# EasyEDA Pro project 智能开关_v2.eprj

# Schematic Schematic1
Create Date: 2024-02-22; Page Name: P1; Project Name: 智能开关; Schematic Name: Schematic1; Update Date: 2024-02-26; Drawed: 赛博小姬; Page Size: A4; Version: V1.0
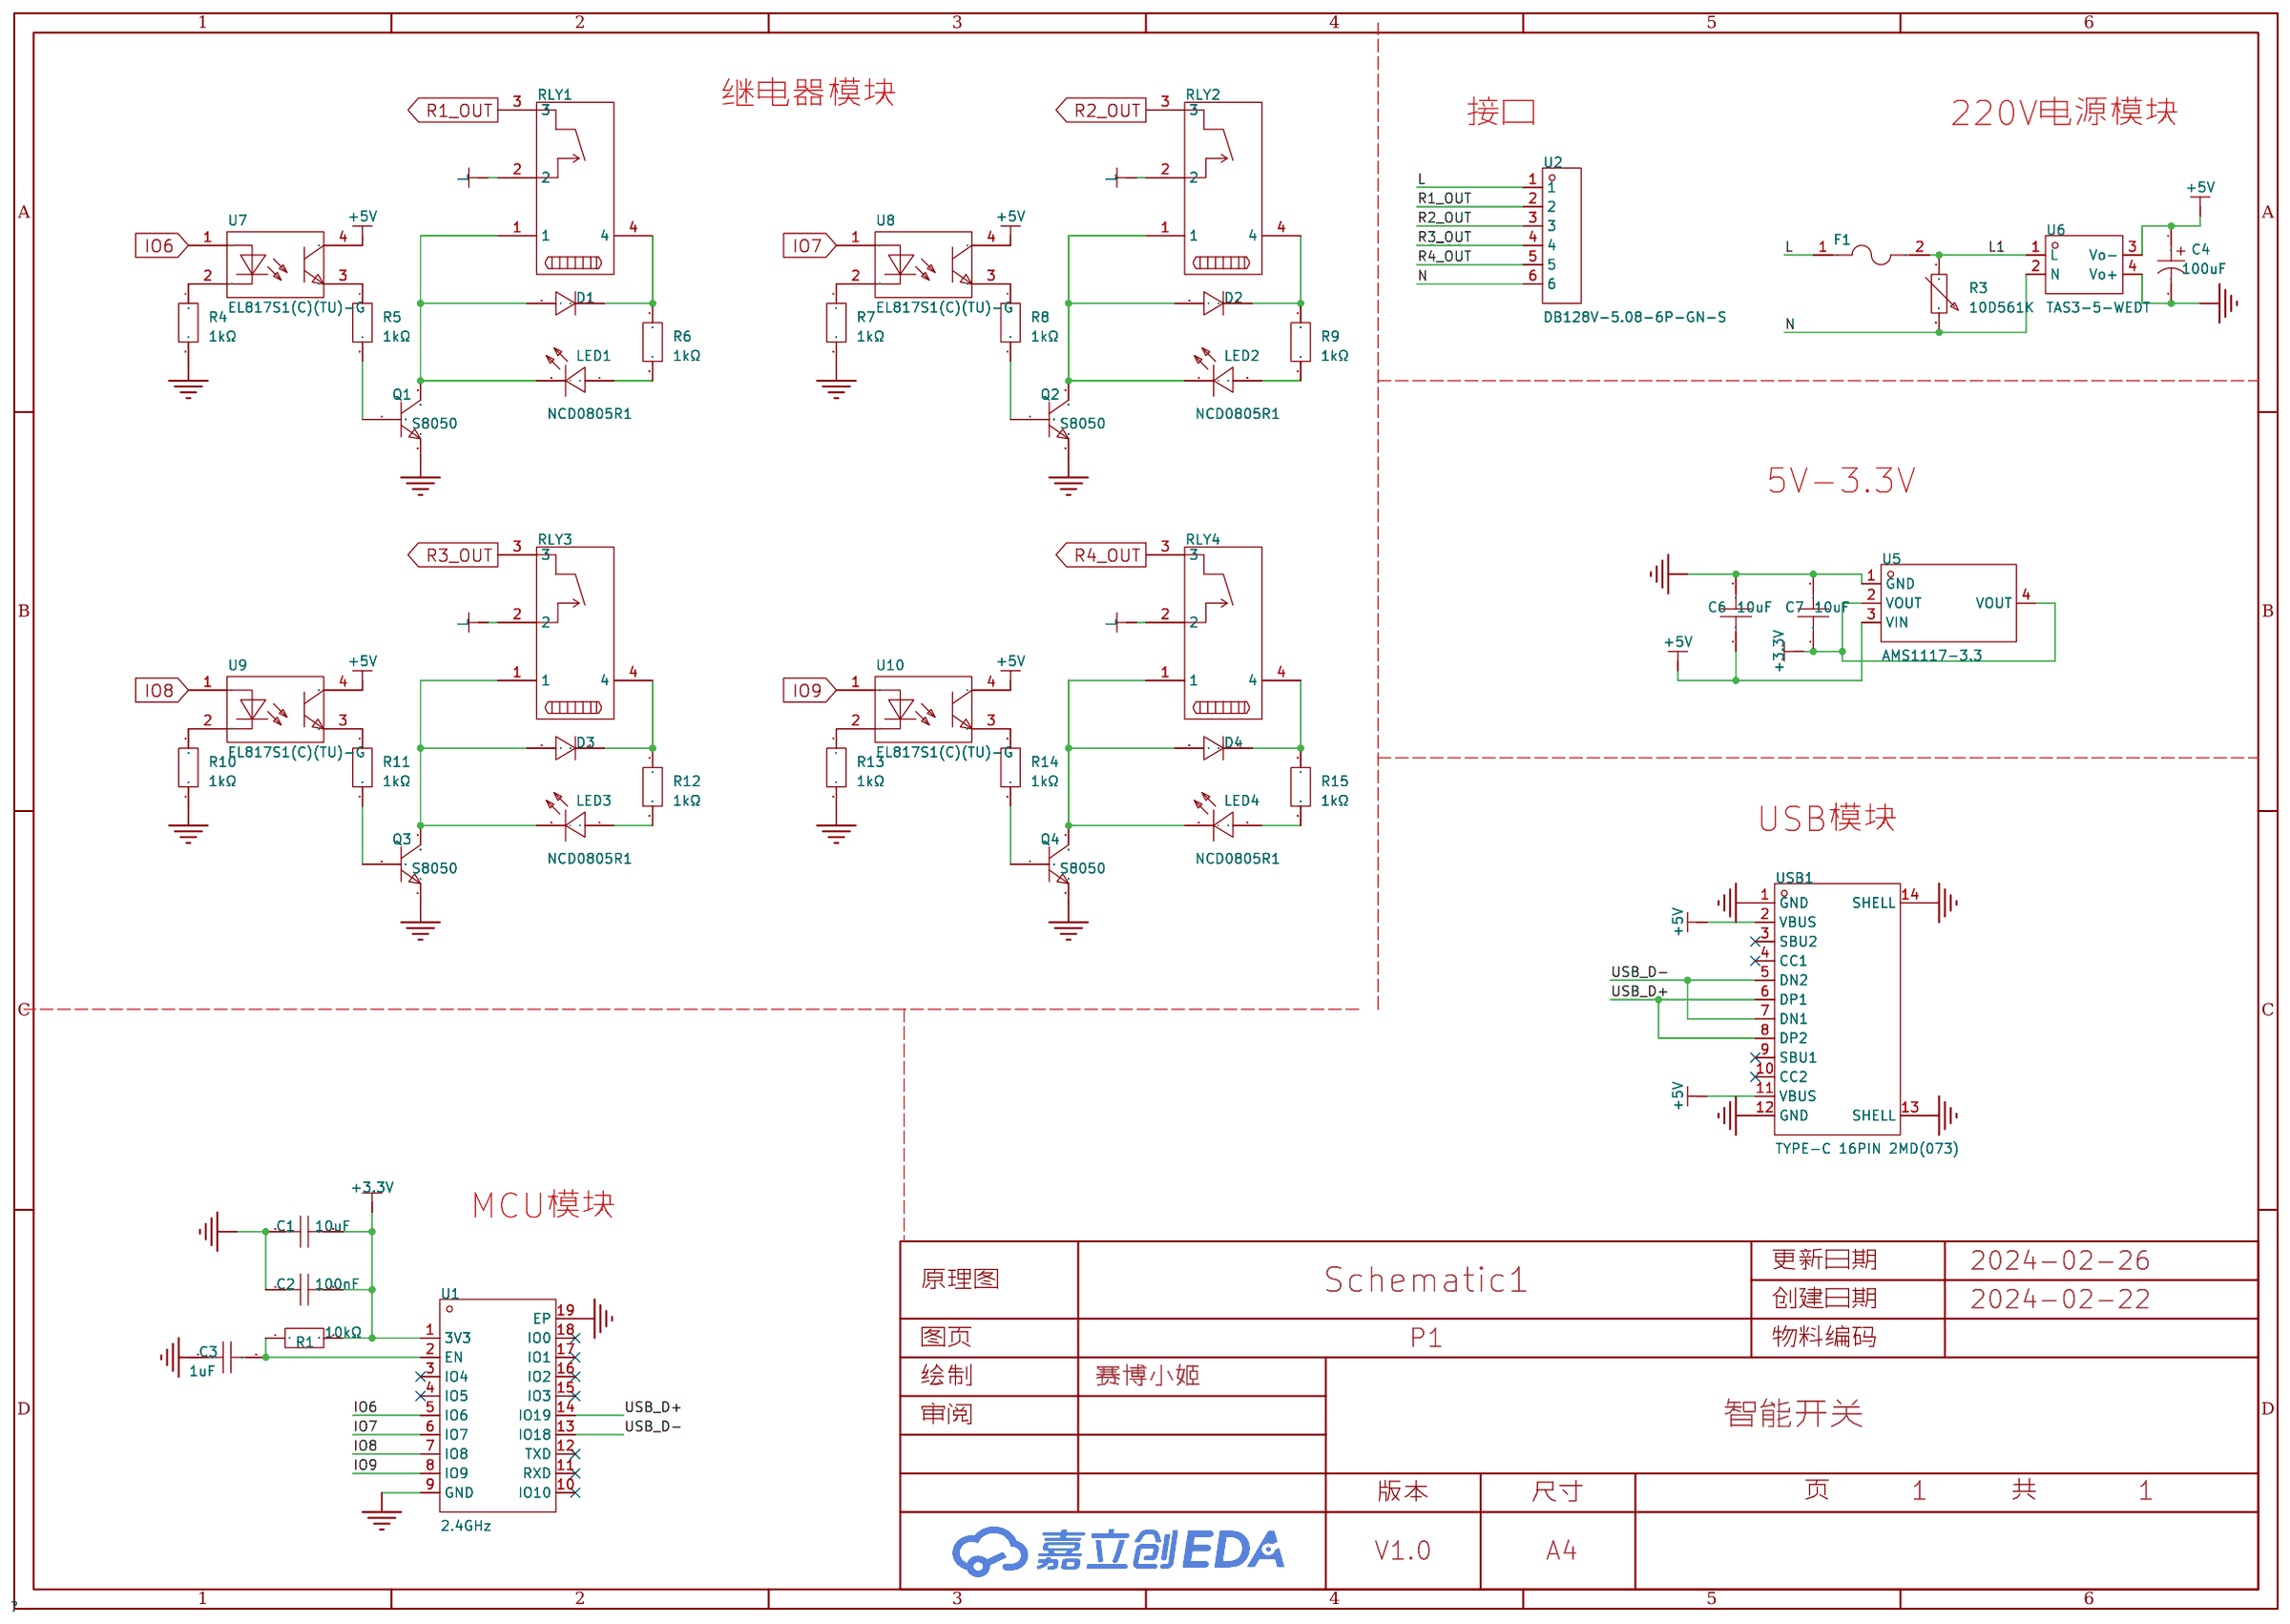
[diagram p0: schematic sheet]

## Parts
C1  10uF  [C0603]
C2  100nF  [C0603]
C3  1uF  [C0603]
C4  100uF  [CAP-SMD_BD6.3-L6.6-W6.6-LS7.3-FD]
C6  10uF  [C0603]
C7  10uF  [C0603]
D1  M4  [SMA_L4.3-W2.6-LS5.2-RD]
D2  M4  [SMA_L4.3-W2.6-LS5.2-RD]
D3  M4  [SMA_L4.3-W2.6-LS5.2-RD]
D4  M4  [SMA_L4.3-W2.6-LS5.2-RD]
F1  JFC2410-1200TS  [F2410]
LED1  NCD0805R1  [LED0805-R-RD]
LED2  NCD0805R1  [LED0805-R-RD]
LED3  NCD0805R1  [LED0805-R-RD]
LED4  NCD0805R1  [LED0805-R-RD]
Q1  S8050  [SOT-23-3_L2.9-W1.3-P1.90-LS2.4-BR]
Q2  S8050  [SOT-23-3_L2.9-W1.3-P1.90-LS2.4-BR]
Q3  S8050  [SOT-23-3_L2.9-W1.3-P1.90-LS2.4-BR]
Q4  S8050  [SOT-23-3_L2.9-W1.3-P1.90-LS2.4-BR]
R1  10kΩ  [R0603]
R3  10D561K  [RES-TH_L13.0-W6.0-P7.50-D0.9-S6.00]
R4  1kΩ  [R0603]
R5  1kΩ  [R0603]
R6  1kΩ  [R0402]
R7  1kΩ  [R0603]
R8  1kΩ  [R0603]
R9  1kΩ  [R0402]
R10  1kΩ  [R0603]
R11  1kΩ  [R0603]
R12  1kΩ  [R0402]
R13  1kΩ  [R0603]
R14  1kΩ  [R0603]
R15  1kΩ  [R0402]
RLY1  G5NB-1A-E-DC5V  [RELAY-TH_G5NB-1A-E-DCXX]
RLY2  G5NB-1A-E-DC5V  [RELAY-TH_G5NB-1A-E-DCXX]
RLY3  G5NB-1A-E-DC5V  [RELAY-TH_G5NB-1A-E-DCXX]
RLY4  G5NB-1A-E-DC5V  [RELAY-TH_G5NB-1A-E-DCXX]
U1  2.4GHz  [BULETM-SMD_ESPRESSIF_ESP32-C3-WROOM-02-N4-4MB]
U2  DB128V-5.08-6P-GN-S  [CONN-TH_6P-P5.08_DIBO_DB128V-5.08]
U5  AMS1117-3.3  [SOT-223-3_L6.5-W3.4-P2.30-LS7.0-BR]
U6  TAS3-5-WEDT  [PWRM-TH_TAS3-XX-WEDT]
U7  EL817S1(C)(TU)-G  [OPTO-SMD-4_L4.6-W6.5-P2.54-LS10.3-TL]
U8  EL817S1(C)(TU)-G  [OPTO-SMD-4_L4.6-W6.5-P2.54-LS10.3-TL]
U9  EL817S1(C)(TU)-G  [OPTO-SMD-4_L4.6-W6.5-P2.54-LS10.3-TL]
U10  EL817S1(C)(TU)-G  [OPTO-SMD-4_L4.6-W6.5-P2.54-LS10.3-TL]
USB1  TYPE-C 16PIN 2MD(073)  [USB-C-SMD_TYPE-C-6PIN-2MD-073]

## Library data of the parts
C1 = CL10A106KP8NNNC: 容值:10uF;精度:±10%;额定电压:10V;材质(温度系数):X5R;; LCSC Part Name: 10uF ±10% 10V; Supplier Part: C19702; Manufacturer: SAMSUNG(三星); Supplier Footprint: 0603; JLCPCB Part Class: Basic Part; Datasheet: https://atta.szlcsc.com/upload/public/pdf/source/20160218/1457707763339.pdf; Supplier: LCSC; Tolerance: ±10%; Voltage Rated: 10V; Temperature Coefficient: X5R
C2 = CC0603KRX7R9BB104: 容值:100nF;精度:±10%;额定电压:50V;材质(温度系数):X7R;; LCSC Part Name: 100nF ±10% 50V; Supplier Part: C14663; Manufacturer: YAGEO(国巨); Supplier Footprint: 0603; JLCPCB Part Class: Basic Part; Datasheet: https://atta.szlcsc.com/upload/public/pdf/source/20180910/C282072_33301C7F631E79921B82A8DAC6BCC5B3.pdf; Supplier: LCSC; Tolerance: ±10%; Voltage Rated: 50V; Temperature Coefficient: X7R
C3 = AC0603KRX7R8BB105: 容值:1uF;精度:±10%;额定电压:25V;材质(温度系数):X7R;; LCSC Part Name: 1uF ±10% 25V; Supplier Part: C726560; Manufacturer: YAGEO(国巨); Supplier Footprint: 0603; JLCPCB Part Class: 扩展库; Datasheet: https://atta.szlcsc.com/upload/public/pdf/source/20200820/C726560_B4B2560EFD85E96D92AFCD5D296BB6F1.pdf; Supplier: LCSC; Tolerance: ±10%; Voltage Rated: 25V; Temperature Coefficient: X7R
C4 = RST100UF25V004: 容值:100uF;精度:±20%;额定电压:25V;纹波电流:88mA@120Hz;等效串联电阻:-;; LCSC Part Name: 100uF ±20% 25V; Supplier Part: C4747964; Manufacturer: KNSCHA(科尼盛); Supplier Footprint: SMD,D6.3xL5.4mm; JLCPCB Part Class: 扩展库; Datasheet: https://atta.szlcsc.com/upload/public/pdf/source/20220722/52F6C209ACF875FF59C64C72CE2329EE.pdf; Supplier: LCSC; Tolerance: ±20%; Rated Voltage: 25V; Ripple Current: 88mA@120Hz; φD: 6.3mm; L: 5.4mm; Lifetime @ Temp: 2000hrs@105℃; Operating Temperature: -40℃~+105℃
C6 C7 = 0603X106M250NT: 容值:10uF;精度:±20%;额定电压:25V;材质(温度系数):X5R;; LCSC Part Name: 10uF ±20% 25V; Supplier Part: C479655; Manufacturer: FH(风华); Supplier Footprint: 0603; JLCPCB Part Class: 扩展库; Datasheet: https://atta.szlcsc.com/upload/public/pdf/source/20200305/C486355_26A10D38EF8C2A5C37091D0039909270.pdf; Supplier: LCSC; Tolerance: ±20%; Voltage Rated: 25V; Temperature Coefficient: X5R
D1-D4 = M4_C18207: 二极管配置:-;正向压降(Vf):1.1V@1A;直流反向耐压(Vr):400V;平均整流电流(Io):1A;; LCSC Part Name: 电压:400V 电流:1A; Supplier Part: C18207; Manufacturer: 星海; Supplier Footprint: SMA(DO-214AC); JLCPCB Part Class: 扩展库; Datasheet: https://atta.szlcsc.com/upload/public/pdf/source/20161112/1478931640032.pdf; Supplier: LCSC; Forward Voltage (Vf@If): 1.1V@1A; Reverse Voltage (Vr): 400V; Average Rectified Current (Io): 1A; Reverse Leakage Current: 5uA@400V
F1 = JFC2410-1200TS: 类型:贴片式保险丝;额定电流:2A;额定电压 (AC):250V;额定电压 (DC):250V;分断能力:50A;; LCSC Part Name: 250V贴片式保险丝; Supplier Part: C136382; Manufacturer: JDTfuse(集电通); Supplier Footprint: SMD; JLCPCB Part Class: 扩展库; Datasheet: https://atta.szlcsc.com/upload/public/pdf/source/20230515/1D43BDD82FA89335B41B370141760CD9.pdf; Supplier: LCSC; Type: 贴片式保险丝; Current Rating: 2A; Voltage Rating  (AC): 250V; Voltage Rating (DC): 250V; Operating Temperature: -55℃~+125℃; Breaking Capacity: 50A
LED1-LED4 = NCD0805R1: 灯头类型:-;发光颜色:红色;正向电压(VF):1.6V~2.6V;功率:65mW;正向电流:20mA;主波长:615nm~630nm;二极管配置:独立二极管;透镜颜色:无色透明透镜;色温:-;发光强度:67mcd~195mcd;发光角度:130°;载带方式:-;工作温度:-30℃~+85℃;; Supplier Part: C84256; Manufacturer: 国星光电; Supplier Footprint: 0805; JLCPCB Part Class: 基础库; Datasheet: https://atta.szlcsc.com/upload/public/pdf/source/20200820/C84256_F0A75A43B3EAD75808600A0514C76B99.pdf; Supplier: LCSC; Emitted Color: 红色; Forward Voltage (VF): 1.6V~2.6V; Power Dissipation: 65mW; Forward Current: 20mA; Dominant Wavelength: 615nm~630nm; Diode Configuration: 独立二极管; Lens Color: 无色透明透镜; Luminous Intensity: 67mcd~195mcd; Viewing Angle: 130°; Operating Temperature: -30℃~+85℃
Q1-Q4 = S8050_C139514: 晶体管类型:NPN;集电极电流(Ic):500mA;集射极击穿电压(Vceo):25V;功率(Pd):300mW;; LCSC Part Name: 耐压:25V 电流:500mA NPN; Supplier Part: C139514; Supplier Footprint: SOT-23; JLCPCB Part Class: 扩展库; Datasheet: https://atta.szlcsc.com/upload/public/pdf/source/20171116/C139514_15108221321741123744.pdf; Supplier: LCSC; Transistor Type: NPN; Collector Current (Ic): 500mA; Collector-Emitter Breakdown Voltage (Vceo): 25V; Power Dissipation (Pd): 300mW
R1 = SC0603F1002F2BNRH: 阻值:10kΩ;精度:±1%;功率:-;温度系数:±100ppm/℃;; LCSC Part Name: 10kΩ ±1%; Supplier Part: C3152123; Manufacturer: Sunway(信维通信); Supplier Footprint: 0603; JLCPCB Part Class: 扩展库; Datasheet: https://atta.szlcsc.com/upload/public/pdf/source/20220728/FFCE43BB6DF8FA16AEE331F0F4B289DE.pdf; Supplier: LCSC; Tolerance: ±1%; Temperature Coefficient: ±100ppm/℃
R3 = 10D561K_C113236: 压敏电压:504V~616V;钳位电压:920V;最大工作电压(DC):460V;最大工作电压(AC):350V;; LCSC Part Name: 钳位电压920V 42.3焦耳 插件压敏电阻; Supplier Part: C113236; Manufacturer: HEL(鸿志); Supplier Footprint: 插件; Datasheet: https://atta.szlcsc.com/upload/public/pdf/source/20171026/C136820_15089842275381059197.pdf; Supplier: LCSC; Varistor Voltage: 504V~616V; Clamping Voltage: 920V; Allowable Voltage (DC): 460V; Allowable Voltage (AC): 350V; Peak Current: 2.5kA; Maximum Energy: 42.3J; Typical Capatitance: 180pF@1kHz
R4 R5 R7 R8 R10 R11 R13 R14 = SCR0603F1K: 电阻类型:厚膜电阻;阻值:1kΩ;精度:±1%;功率:100mW;最大工作电压:75V;; LCSC Part Name: 厚膜电阻 1kΩ ±1% 100mW; Supplier Part: C3016283; Manufacturer: VO(翔胜); Supplier Footprint: 0603; JLCPCB Part Class: 扩展库; Datasheet: https://atta.szlcsc.com/upload/public/pdf/source/20220513/247AF9639BA21CF93567DC289CCC6A22.pdf; Supplier: LCSC; Type: 厚膜电阻; Tolerance: ±1%; Power(Watts): 100mW; Overload Voltage (Max): 75V; Operating Temperature Range: -55℃~+155℃
R6 R9 R12 R15 = RT0402FRE131KL: 电阻类型:薄膜电阻;阻值:1kΩ;精度:±1%;功率:63mW;温度系数:±50ppm/℃;; LCSC Part Name: 薄膜电阻 1kΩ ±1% 63mW; Supplier Part: C5455558; Manufacturer: YAGEO(国巨); Supplier Footprint: 0402; JLCPCB Part Class: 扩展库; Datasheet: https://atta.szlcsc.com/upload/public/pdf/source/20221229/9BDC4C850F6F9D95EFF69854CFE12DCA.pdf; Supplier: LCSC; Type: 薄膜电阻; Tolerance: ±1%; Power(Watts): 63mW; Temperature Coefficient: ±50ppm/℃; Operating Temperature Range: -55℃~+155℃
RLY1-RLY4 = G5NB-1A-E-DC5V: 线圈电压:-;触点形式:-;触点容量(电阻负载):-;最大切换电压:-;最大切换电流:-;; Supplier Part: C48746; Manufacturer: OMRON(欧姆龙); Supplier Footprint: 插件,7x20.4mm; JLCPCB Part Class: 扩展库; Supplier: LCSC
U1 = ESP32-C3-WROOM-02-N4: 核心处理器:ESP32-C3芯片;频率:2.4GHz;发射功率:20.5dBm;; Supplier Part: C2934560; Manufacturer: ESPRESSIF(乐鑫); Supplier Footprint: VFQFN-32-EP; JLCPCB Part Class: 扩展库; Datasheet: https://atta.szlcsc.com/upload/public/pdf/source/20220106/F07459EFFE1D7CBA94B4FB8A075146A6.pdf; Supplier: LCSC; Core Processor: ESP32-C3芯片; Support Interface: I2C；GPIO；SPI；JTAG；UART；USB；I2S; Output Power: 20.5dBm
U2 = DB128V-5.08-6P-GN-S: 结构:1x6P;间距:5.08mm;颜色:绿色;安装方式:直插;额定电流:20A;额定电压:300V;排数:1;线规 - AWG:12~30;线规 - 平方毫米:2.5;每排PIN数:6;工作温度范围:-40℃~+105℃;; LCSC Part Name: 5.08mm 1x6P 排数:1 每排P数:6 直插; Supplier Part: C2915642; Manufacturer: DORABO(地博电气); Supplier Footprint: 插件,P=5.08mm; JLCPCB Part Class: Extended Part; Datasheet: https://atta.szlcsc.com/upload/public/pdf/source/20230106/CC449C10514519CDCE20F1C37DBF2DAC.pdf; Supplier: LCSC; Structure: 1x6P; Pitch: 5.08mm; Color: 绿色; Mounting Style: 直插; Current Rating (Max): 20A; Voltage Rating (Max): 300V; Number of Pins: 6P; Number of Rows: 1; Wire Gauge - AWG: 12~30; Wire Gauge - mm2: 2.5; Number of PINs Per Row: 6; Operating Temperature Range: -40℃~+105℃; Contact Material: 铜合金; Contact Plating: 锡
U5 = AMS1117-3.3_C6186: 输出类型:固定;最大输入电压:-;输出电压:3.3V;最大输出电流:1A;电源纹波抑制比(PSRR):72dB@(120Hz);输出极性:正极;; LCSC Part Name: 输出3.3V 1A; Supplier Part: C6186; Manufacturer: AMS; Supplier Footprint: SOT-223-3; JLCPCB Part Class: 基础库; Datasheet: https://atta.szlcsc.com/upload/public/pdf/source/20180727/C6186_7A095716F0823C02F1997A905E26C086.pdf; Supplier: LCSC; Output Type: 固定; Output Voltage: 3.3V; MAX Output Current: 1A; Power Supply Rejection Ratio (PSRR): 72dB@(120Hz); Dropout Voltage: 1.3V@(800mA); Output Polarity: 正极; Number of Outputs: 1
U6 = TAS3-5-WEDT: 转换类型:AC-DC；AC/DC-DC;输入电压(DC):100V~370V;输出电压:5V;输出功率:3W;输入电压(AC):85VAC~265VAC;输出电流(最大值):600mA;功能类型:降压型;转换效率:75%;; Supplier Part: C570795; Manufacturer: TDPOWER(腾达电源); Supplier Footprint: 插件,19x38mm; JLCPCB Part Class: 扩展库; Datasheet: https://atta.szlcsc.com/upload/public/pdf/source/20200629/C570795_2BCE2CBAC4D476E03C2D62BDB5C231E8.pdf; Supplier: LCSC; Conversion Type: AC-DC；AC/DC-DC; Input Voltage(DC): 100V~370V; Output Voltage: 5V; Output Power: 3W; Input Voltage(AC): 85VAC~265VAC; Output Current (Max): 600mA; Function: 降压型; Isolation or not: 隔离; Output Channel: 1; Insulated Voltage: 2.5kV@AC; Conversion Efficiency: 75%; Feature: 过流保护；短路保护自恢复
U7-U10 = EL817S1(C)(TU)-G: 输入电压类型:DC;正向电压:1.2V;输出电流:50mA;隔离电压(rms):5kV;反向电压:6V;接收端电压:35V;输出通道数:1;集射极饱和电压(Vce(sat)@Ic,IF):100mV@1mA,20mA;; LCSC Part Name: DC输入 隔离电压(rms):5000V; Supplier Part: C414641; Manufacturer: EVERLIGHT(亿光); Supplier Footprint: SMD-4P; JLCPCB Part Class: 扩展库; Datasheet: https://atta.szlcsc.com/upload/public/pdf/source/20190822/C414642_3676B2E93CB19DCF416503E5753ACA8D.pdf; Supplier: LCSC; Input voltage type: DC; Output Type: 光电三极管; Forward Voltage: 1.2V; Output Current: 50mA; Isolation Voltage(rms): 5kV; Reverse Voltage: 6V; Receiving End Voltage: 35V; Number of Outputs: 1; Collector-Emitter Saturation Voltage (Vce(sat)@Ic,IF): 100mV@1mA,20mA; Rise time: 18us@2mA,100Ω; Fall time: 18us@2mA,100Ω; Operating Temperature: -55℃~+110℃
USB1 = TYPE-C 16PIN 2MD(073): 连接器类型:Type-C;标准:-;公母:母;端口数量:1;触点数量:16P;安装方式:卧贴;额定电流 - 电源:5A;工作温度范围:-25℃~+85℃;; LCSC Part Name: Type-C 母 卧贴; Supplier Part: C2765186; Manufacturer: SHOU HAN(首韩); Supplier Footprint: SMD; JLCPCB Part Class: 扩展库; Datasheet: https://atta.szlcsc.com/upload/public/pdf/source/20211123/39B17C16241EAC15C5E277BDA434118E.pdf; Supplier: LCSC; Connector Type: Type-C; Gender: 母; Number of Ports: 1; Number of Contacts: 16P; Mounting Style: 卧贴; Current Rating - Power (Max): 5A; Operating Temperature Range: -25℃~+85℃

## Nets
+3.3V: C1.2 C2.2 C7.1 R1.2 U1.1(3V3) U5.2(VOUT) U5.4(VOUT)
+5V: C4.1 C6.1 U5.3(VIN) U6.3(Vo-) U7.4 U8.4 U9.4 U10.4 USB1.2(VBUS) USB1.11(VBUS)
GND: C1.1 C2.1 C3.1 C4.2 C6.2 C7.2 Q1.2(E) Q2.2(E) Q3.2(E) Q4.2(E) R4.2 R7.2 R10.2 R13.2 U1.9(GND) U1.19(EP) U5.1(GND) U6.4(Vo+) USB1.1(GND) USB1.12(GND) USB1.13(SHELL) USB1.14(SHELL)
IO6: U1.5(IO6) U7.1
IO7: U1.6(IO7) U8.1
IO8: U1.7(IO8) U9.1
IO9: U1.8(IO9) U10.1
L: F1.1 RLY1.2 RLY2.2 RLY3.2 RLY4.2 U2.1
L1: F1.2 R3.1 U6.1(L)
N: R3.2 U2.6 U6.2(N)
R1_OUT: RLY1.3 U2.2
R2_OUT: RLY2.3 U2.3
R3_OUT: RLY3.3 U2.4
R4_OUT: RLY4.3 U2.5
USB_D+: U1.14(IO19) USB1.6(DP1) USB1.8(DP2)
USB_D-: U1.13(IO18) USB1.5(DN2) USB1.7(DN1)
$1N798: C3.2 R1.1 U1.2(EN)
$1N5128: R4.1 U7.2
$1N5169: R5.1 U7.3
$1N5245: Q1.1(B) R5.2
$1N5743: D1.1(K) R6.1 RLY1.4
$1N5747: LED1.1(+) R6.2
$1N5759: D1.2(A) LED1.2(-) Q1.3(C) RLY1.1
$1N6153: R7.1 U8.2
$1N6157: R8.1 U8.3
$1N6159: Q2.1(B) R8.2
$1N6167: D2.1(K) R9.1 RLY2.4
$1N6170: LED2.1(+) R9.2
$1N6172: D2.2(A) LED2.2(-) Q2.3(C) RLY2.1
$1N6567: R10.1 U9.2
$1N6571: R11.1 U9.3
$1N6573: Q3.1(B) R11.2
$1N6581: D3.1(K) R12.1 RLY3.4
$1N6584: LED3.1(+) R12.2
$1N6586: D3.2(A) LED3.2(-) Q3.3(C) RLY3.1
$1N6981: R13.1 U10.2
$1N6985: R14.1 U10.3
$1N6987: Q4.1(B) R14.2
$1N6995: D4.1(K) R15.1 RLY4.4
$1N6998: LED4.1(+) R15.2
$1N7000: D4.2(A) LED4.2(-) Q4.3(C) RLY4.1

Not connected (* = marked no-connect by the designer): U1 3(IO4)* 4(IO5)* 10(IO10)* 11(RXD)* 12(TXD)* 15(IO3)* 16(IO2)* 17(IO1)* 18(IO0)*; USB1 3(SBU2)* 4(CC1)* 9(SBU1)* 10(CC2)*

## Notes on the sheet
- 继电器模块
- 接口
- 220V电源模块
- 5V-3.3V
- USB模块
- MCU模块

# Schematic Schematic2
Create Date: 2024-02-26; Page Name: P1; Project Name: 智能开关_v2; Schematic Name: Schematic2; Update Date: 2024-02-26; Drawed: 赛博小姬; Page Size: A4; Version: V1.0
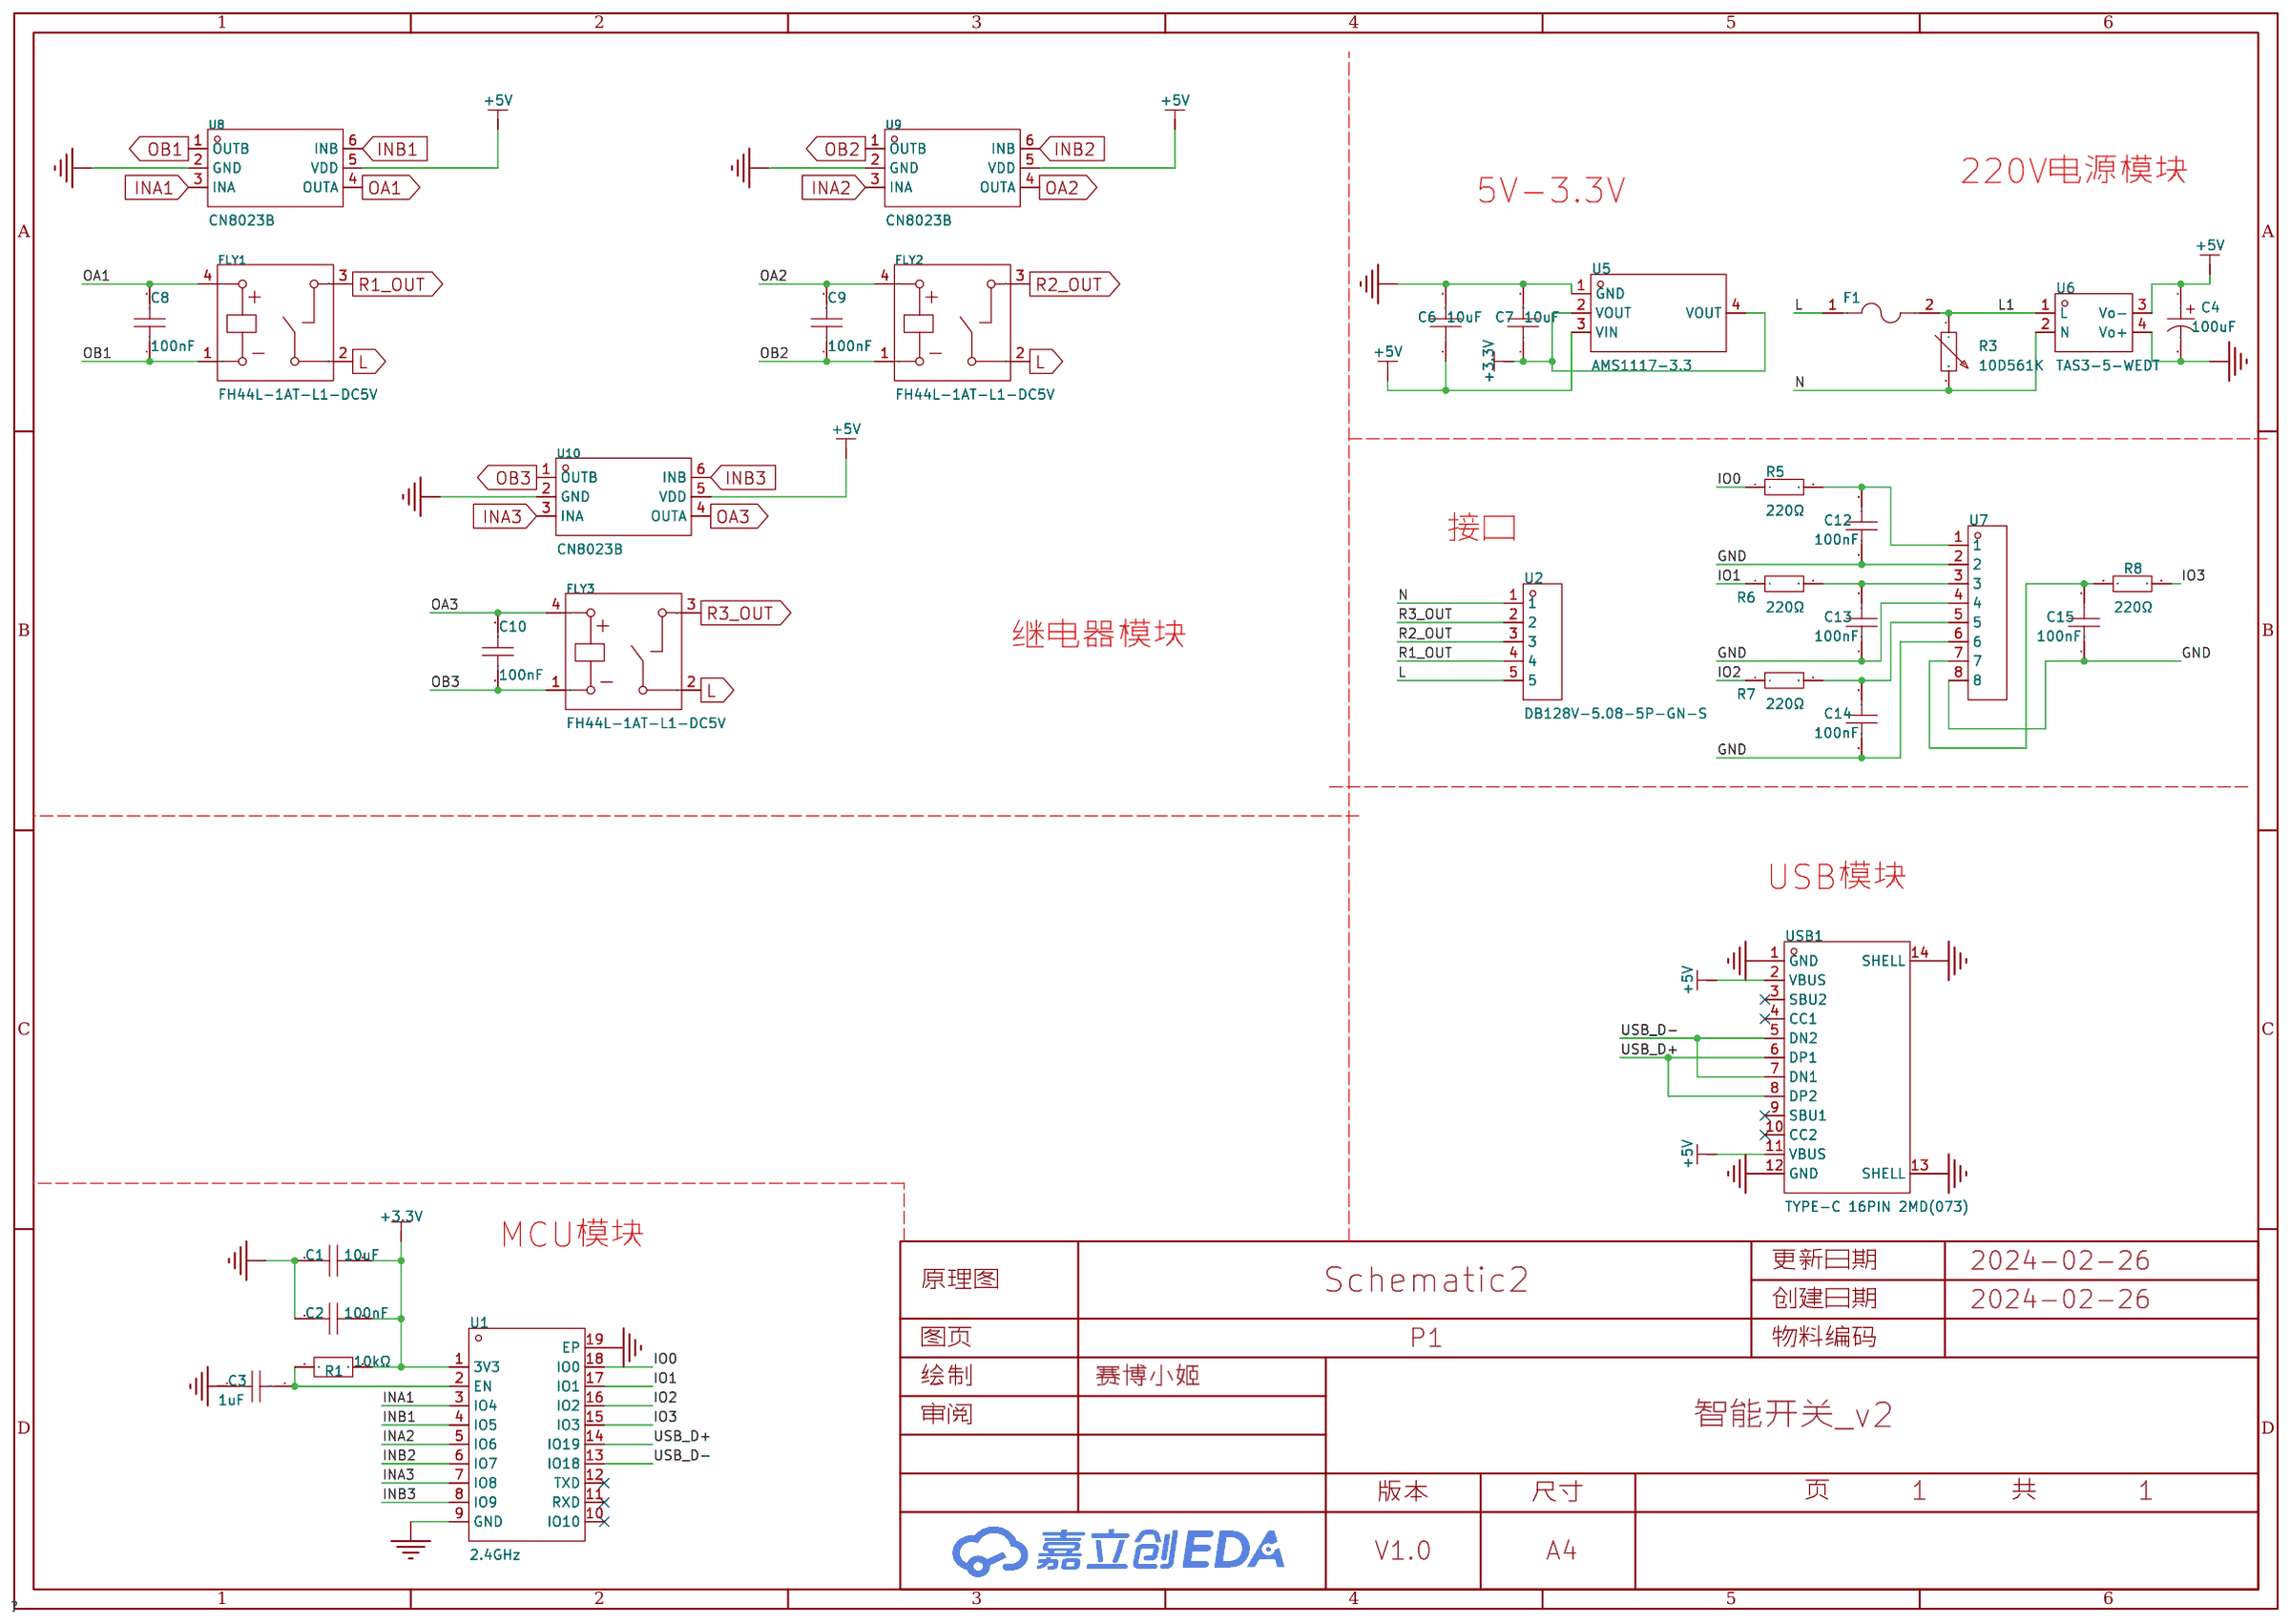
[diagram p1: schematic sheet]

## Parts
C1  10uF  [C0603]
C2  100nF  [C0603]
C3  1uF  [C0603]
C4  100uF  [CAP-SMD_BD6.3-L6.6-W6.6-LS7.3-FD]
C6  10uF  [C0603]
C7  10uF  [C0603]
C8  100nF  [C0603]
C9  100nF  [C0603]
C10  100nF  [C0603]
C12  100nF  [C0603]
C13  100nF  [C0603]
C14  100nF  [C0603]
C15  100nF  [C0603]
F1  JFC2410-1200TS  [F2410]
FLY1  FH44L-1AT-L1-DC5V  [RELAY-TH_FH44L-1AT-L1-DC5V]
FLY2  FH44L-1AT-L1-DC5V  [RELAY-TH_FH44L-1AT-L1-DC5V]
FLY3  FH44L-1AT-L1-DC5V  [RELAY-TH_FH44L-1AT-L1-DC5V]
R1  10kΩ  [R0603]
R3  10D561K  [RES-TH_L13.0-W6.0-P7.50-D0.9-S6.00]
R5  220Ω  [R0402]
R6  220Ω  [R0402]
R7  220Ω  [R0402]
R8  220Ω  [R0402]
U1  2.4GHz  [BULETM-SMD_ESPRESSIF_ESP32-C3-WROOM-02-N4-4MB]
U2  DB128V-5.08-5P-GN-S  [CONN-TH_5P-P5.08_DIBO_DB128V-5.08-5P-GN-S]
U5  AMS1117-3.3  [SOT-223-3_L6.5-W3.4-P2.30-LS7.0-BR]
U6  TAS3-5-WEDT  [PWRM-TH_TAS3-XX-WEDT]
U7  DB125-2.54-8P-GN-S  [CONN-TH_DB125-2.54-8P-GN]
U8  CN8023B  [SOT-23-6_L2.9-W1.6-P0.95-LS2.8-BR]
U9  CN8023B  [SOT-23-6_L2.9-W1.6-P0.95-LS2.8-BR]
U10  CN8023B  [SOT-23-6_L2.9-W1.6-P0.95-LS2.8-BR]
USB1  TYPE-C 16PIN 2MD(073)  [USB-C-SMD_TYPE-C-6PIN-2MD-073]

## Library data of the parts
C1 = CL10A106KP8NNNC: 容值:10uF;精度:±10%;额定电压:10V;材质(温度系数):X5R;; LCSC Part Name: 10uF ±10% 10V; Supplier Part: C19702; Manufacturer: SAMSUNG(三星); Supplier Footprint: 0603; JLCPCB Part Class: Basic Part; Datasheet: https://atta.szlcsc.com/upload/public/pdf/source/20160218/1457707763339.pdf; Supplier: LCSC; Tolerance: ±10%; Voltage Rated: 10V; Temperature Coefficient: X5R
C2 = CC0603KRX7R9BB104: 容值:100nF;精度:±10%;额定电压:50V;材质(温度系数):X7R;; LCSC Part Name: 100nF ±10% 50V; Supplier Part: C14663; Manufacturer: YAGEO(国巨); Supplier Footprint: 0603; JLCPCB Part Class: Basic Part; Datasheet: https://atta.szlcsc.com/upload/public/pdf/source/20180910/C282072_33301C7F631E79921B82A8DAC6BCC5B3.pdf; Supplier: LCSC; Tolerance: ±10%; Voltage Rated: 50V; Temperature Coefficient: X7R
C3 = AC0603KRX7R8BB105: 容值:1uF;精度:±10%;额定电压:25V;材质(温度系数):X7R;; LCSC Part Name: 1uF ±10% 25V; Supplier Part: C726560; Manufacturer: YAGEO(国巨); Supplier Footprint: 0603; JLCPCB Part Class: 扩展库; Datasheet: https://atta.szlcsc.com/upload/public/pdf/source/20200820/C726560_B4B2560EFD85E96D92AFCD5D296BB6F1.pdf; Supplier: LCSC; Tolerance: ±10%; Voltage Rated: 25V; Temperature Coefficient: X7R
C4 = RST100UF25V004: 容值:100uF;精度:±20%;额定电压:25V;纹波电流:88mA@120Hz;等效串联电阻:-;; LCSC Part Name: 100uF ±20% 25V; Supplier Part: C4747964; Manufacturer: KNSCHA(科尼盛); Supplier Footprint: SMD,D6.3xL5.4mm; JLCPCB Part Class: 扩展库; Datasheet: https://atta.szlcsc.com/upload/public/pdf/source/20220722/52F6C209ACF875FF59C64C72CE2329EE.pdf; Supplier: LCSC; Tolerance: ±20%; Rated Voltage: 25V; Ripple Current: 88mA@120Hz; φD: 6.3mm; L: 5.4mm; Lifetime @ Temp: 2000hrs@105℃; Operating Temperature: -40℃~+105℃
C6 C7 = 0603X106M250NT: 容值:10uF;精度:±20%;额定电压:25V;材质(温度系数):X5R;; LCSC Part Name: 10uF ±20% 25V; Supplier Part: C479655; Manufacturer: FH(风华); Supplier Footprint: 0603; JLCPCB Part Class: 扩展库; Datasheet: https://atta.szlcsc.com/upload/public/pdf/source/20200305/C486355_26A10D38EF8C2A5C37091D0039909270.pdf; Supplier: LCSC; Tolerance: ±20%; Voltage Rated: 25V; Temperature Coefficient: X5R
C8-C10 C12-C15 = C1608JB1H104KT000N: 容值:100nF;精度:±10%;额定电压:50V;材质(温度系数):JB;; LCSC Part Name: 100nF ±10% 50V; Supplier Part: C190071; Manufacturer: TDK; Supplier Footprint: 0603; Datasheet: https://atta.szlcsc.com/upload/public/pdf/source/20190322/C361206_9C300BFAC6DE9FB712DF280041B5B925.pdf; Supplier: LCSC; Tolerance: ±10%; Voltage Rated: 50V; Temperature Coefficient: JB
F1 = JFC2410-1200TS: 类型:贴片式保险丝;额定电流:2A;额定电压 (AC):250V;额定电压 (DC):250V;分断能力:50A;; LCSC Part Name: 250V贴片式保险丝; Supplier Part: C136382; Manufacturer: JDTfuse(集电通); Supplier Footprint: SMD; JLCPCB Part Class: 扩展库; Datasheet: https://atta.szlcsc.com/upload/public/pdf/source/20230515/1D43BDD82FA89335B41B370141760CD9.pdf; Supplier: LCSC; Type: 贴片式保险丝; Current Rating: 2A; Voltage Rating  (AC): 250V; Voltage Rating (DC): 250V; Operating Temperature: -55℃~+125℃; Breaking Capacity: 50A
FLY1-FLY3 = FH44L-1AT-L1-DC5V: Supplier Part: C5332077; Manufacturer: FANHAR(浙江凡华); Supplier Footprint: 插件,10x20.2mm; JLCPCB Part Class: 扩展库; Datasheet: https://atta.szlcsc.com/upload/public/pdf/source/20230425/6566C27B2AA00028D9C147050A63B12F.pdf; Supplier: LCSC
R1 = SC0603F1002F2BNRH: 阻值:10kΩ;精度:±1%;功率:-;温度系数:±100ppm/℃;; LCSC Part Name: 10kΩ ±1%; Supplier Part: C3152123; Manufacturer: Sunway(信维通信); Supplier Footprint: 0603; JLCPCB Part Class: 扩展库; Datasheet: https://atta.szlcsc.com/upload/public/pdf/source/20220728/FFCE43BB6DF8FA16AEE331F0F4B289DE.pdf; Supplier: LCSC; Tolerance: ±1%; Temperature Coefficient: ±100ppm/℃
R3 = 10D561K_C113236: 压敏电压:504V~616V;钳位电压:920V;最大工作电压(DC):460V;最大工作电压(AC):350V;; LCSC Part Name: 钳位电压920V 42.3焦耳 插件压敏电阻; Supplier Part: C113236; Manufacturer: HEL(鸿志); Supplier Footprint: 插件; Datasheet: https://atta.szlcsc.com/upload/public/pdf/source/20171026/C136820_15089842275381059197.pdf; Supplier: LCSC; Varistor Voltage: 504V~616V; Clamping Voltage: 920V; Allowable Voltage (DC): 460V; Allowable Voltage (AC): 350V; Peak Current: 2.5kA; Maximum Energy: 42.3J; Typical Capatitance: 180pF@1kHz
R5-R8 = 0402WGF2200TCE: 电阻类型:厚膜电阻;阻值:220Ω;精度:±1%;功率:62.5mW;最大工作电压:50V;温度系数:±100ppm/℃;; LCSC Part Name: 220Ω ±1% 62.5mW 厚膜电阻; Supplier Part: C25091; Manufacturer: UNI-ROYAL(厚声); Supplier Footprint: 0402; JLCPCB Part Class: 基础库; Datasheet: https://atta.szlcsc.com/upload/public/pdf/source/20200306/C422600_1E6D84923E4A46A82E41ADD87F860B5C.pdf; Supplier: LCSC; Type: 厚膜电阻; Tolerance: ±1%; Power(Watts): 62.5mW; Overload Voltage (Max): 50V; Temperature Coefficient: ±100ppm/℃; Operating Temperature Range: -55℃~+155℃
U1 = ESP32-C3-WROOM-02-N4: 核心处理器:ESP32-C3芯片;频率:2.4GHz;发射功率:20.5dBm;; Supplier Part: C2934560; Manufacturer: ESPRESSIF(乐鑫); Supplier Footprint: VFQFN-32-EP; JLCPCB Part Class: 扩展库; Datasheet: https://atta.szlcsc.com/upload/public/pdf/source/20220106/F07459EFFE1D7CBA94B4FB8A075146A6.pdf; Supplier: LCSC; Core Processor: ESP32-C3芯片; Support Interface: I2C；GPIO；SPI；JTAG；UART；USB；I2S; Output Power: 20.5dBm
U2 = DB128V-5.08-5P-GN-S: 结构:1x5P;间距:5.08mm;颜色:绿色;安装方式:直插;额定电流:20A;额定电压:300V;排数:1;线规 - AWG:12~30;线规 - 平方毫米:2.5;每排PIN数:5;工作温度范围:-40℃~+105℃;; LCSC Part Name: 5.08mm 1x5P 排数:1 每排P数:5 直插; Supplier Part: C2927513; Manufacturer: DORABO(地博电气); Supplier Footprint: 插件,P=5.08mm; JLCPCB Part Class: 扩展库; Datasheet: https://atta.szlcsc.com/upload/public/pdf/source/20230106/CC449C10514519CDCE20F1C37DBF2DAC.pdf; Supplier: LCSC; Structure: 1x5P; Pitch: 5.08mm; Color: 绿色; Mounting Style: 直插; Current Rating (Max): 20A; Voltage Rating (Max): 300V; Number of Pins: 5P; Number of Rows: 1; Wire Gauge - AWG: 12~30; Wire Gauge - mm2: 2.5; Number of PINs Per Row: 5; Operating Temperature Range: -40℃~+105℃
U5 = AMS1117-3.3_C6186: 输出类型:固定;最大输入电压:-;输出电压:3.3V;最大输出电流:1A;电源纹波抑制比(PSRR):72dB@(120Hz);输出极性:正极;; LCSC Part Name: 输出3.3V 1A; Supplier Part: C6186; Manufacturer: AMS; Supplier Footprint: SOT-223-3; JLCPCB Part Class: 基础库; Datasheet: https://atta.szlcsc.com/upload/public/pdf/source/20180727/C6186_7A095716F0823C02F1997A905E26C086.pdf; Supplier: LCSC; Output Type: 固定; Output Voltage: 3.3V; MAX Output Current: 1A; Power Supply Rejection Ratio (PSRR): 72dB@(120Hz); Dropout Voltage: 1.3V@(800mA); Output Polarity: 正极; Number of Outputs: 1
U6 = TAS3-5-WEDT: 转换类型:AC-DC；AC/DC-DC;输入电压(DC):100V~370V;输出电压:5V;输出功率:3W;输入电压(AC):85VAC~265VAC;输出电流(最大值):600mA;功能类型:降压型;转换效率:75%;; Supplier Part: C570795; Manufacturer: TDPOWER(腾达电源); Supplier Footprint: 插件,19x38mm; JLCPCB Part Class: 扩展库; Datasheet: https://atta.szlcsc.com/upload/public/pdf/source/20200629/C570795_2BCE2CBAC4D476E03C2D62BDB5C231E8.pdf; Supplier: LCSC; Conversion Type: AC-DC；AC/DC-DC; Input Voltage(DC): 100V~370V; Output Voltage: 5V; Output Power: 3W; Input Voltage(AC): 85VAC~265VAC; Output Current (Max): 600mA; Function: 降压型; Isolation or not: 隔离; Output Channel: 1; Insulated Voltage: 2.5kV@AC; Conversion Efficiency: 75%; Feature: 过流保护；短路保护自恢复
U7 = DB125-2.54-8P-GN-S: 结构:1x8P;间距:2.54mm;颜色:绿色;安装方式:直插;额定电流:8A;额定电压:130V;排数:1;线规 - AWG:18~26;线规 - 平方毫米:0.5~1;每排PIN数:8;工作温度范围:-40℃~+105℃;; LCSC Part Name: 2.54mm 1x8P 排数:1 每排P数:8 直插; Supplier Part: C918126; Manufacturer: DORABO(地博电气); Supplier Footprint: 插件,P=2.54mm; JLCPCB Part Class: 扩展库; Datasheet: https://atta.szlcsc.com/upload/public/pdf/source/20230106/BCD3A0BE1EB95DC3E813F1745F022035.pdf; Supplier: LCSC; Structure: 1x8P; Pitch: 2.54mm; Color: 绿色; Mounting Style: 直插; Current Rating (Max): 8A; Voltage Rating (Max): 130V; Number of Pins: 8P; Number of Rows: 1; Wire Gauge - AWG: 18~26; Wire Gauge - mm2: 0.5~1; Number of PINs Per Row: 8; Operating Temperature Range: -40℃~+105℃
U8-U10 = CN8023B: CN8023 是双向继电器驱动集成电路，用于控制磁保持继电器的工作，具有输出电流大，静态功耗小灯特点，可广泛应用于智能电表及其他相关行业。; Supplier Part: C3039517; Manufacturer: CNTECH(芯北科技); Supplier Footprint: SOT-23-6; JLCPCB Part Class: 扩展库; Datasheet: https://atta.szlcsc.com/upload/public/pdf/source/20220622/16137FF5811EB8318916E3A401AB2E49.pdf; Supplier: LCSC
USB1 = TYPE-C 16PIN 2MD(073): 连接器类型:Type-C;标准:-;公母:母;端口数量:1;触点数量:16P;安装方式:卧贴;额定电流 - 电源:5A;工作温度范围:-25℃~+85℃;; LCSC Part Name: Type-C 母 卧贴; Supplier Part: C2765186; Manufacturer: SHOU HAN(首韩); Supplier Footprint: SMD; JLCPCB Part Class: 扩展库; Datasheet: https://atta.szlcsc.com/upload/public/pdf/source/20211123/39B17C16241EAC15C5E277BDA434118E.pdf; Supplier: LCSC; Connector Type: Type-C; Gender: 母; Number of Ports: 1; Number of Contacts: 16P; Mounting Style: 卧贴; Current Rating - Power (Max): 5A; Operating Temperature Range: -25℃~+85℃

## Nets
+3.3V: C1.2 C2.2 C7.1 R1.2 U1.1(3V3) U5.2(VOUT) U5.4(VOUT)
+5V: C4.1 C6.1 U5.3(VIN) U6.3(Vo-) U8.5(VDD) U9.5(VDD) U10.5(VDD) USB1.2(VBUS) USB1.11(VBUS)
GND: C1.1 C2.1 C3.1 C4.2 C6.2 C7.2 C12.1 C13.1 C14.1 C15.1 U1.9(GND) U1.19(EP) U5.1(GND) U6.4(Vo+) U7.2 U7.4 U7.6 U7.8 U8.2(GND) U9.2(GND) U10.2(GND) USB1.1(GND) USB1.12(GND) USB1.13(SHELL) USB1.14(SHELL)
INA1: U1.3(IO4) U8.3(INA)
INA2: U1.5(IO6) U9.3(INA)
INA3: U1.7(IO8) U10.3(INA)
INB1: U1.4(IO5) U8.6(INB)
INB2: U1.6(IO7) U9.6(INB)
INB3: U1.8(IO9) U10.6(INB)
IO0: R5.1 U1.18(IO0)
IO1: R6.1 U1.17(IO1)
IO2: R7.1 U1.16(IO2)
IO3: R8.2 U1.15(IO3)
L: F1.1 FLY1.2 FLY2.2 FLY3.2 U2.5
L1: F1.2 R3.1 U6.1(L)
N: R3.2 U2.1 U6.2(N)
OA1: C8.2 FLY1.4 U8.4(OUTA)
OA2: C9.2 FLY2.4 U9.4(OUTA)
OA3: C10.2 FLY3.4 U10.4(OUTA)
OB1: C8.1 FLY1.1 U8.1(OUTB)
OB2: C9.1 FLY2.1 U9.1(OUTB)
OB3: C10.1 FLY3.1 U10.1(OUTB)
R1_OUT: FLY1.3 U2.4
R2_OUT: FLY2.3 U2.3
R3_OUT: FLY3.3 U2.2
USB_D+: U1.14(IO19) USB1.6(DP1) USB1.8(DP2)
USB_D-: U1.13(IO18) USB1.5(DN2) USB1.7(DN1)
$1N911: C3.2 R1.1 U1.2(EN)
$1N5080: C12.2 R5.2 U7.1
$1N5090: C14.2 R7.2 U7.5
$1N5100: C13.2 R6.2 U7.3
$1N5121: C15.2 R8.1 U7.7

Not connected (* = marked no-connect by the designer): U1 10(IO10)* 11(RXD)* 12(TXD)*; USB1 3(SBU2)* 4(CC1)* 9(SBU1)* 10(CC2)*

## Notes on the sheet
- 5V-3.3V
- 220V电源模块
- 接口
- 继电器模块
- USB模块
- MCU模块

# Board PCB1
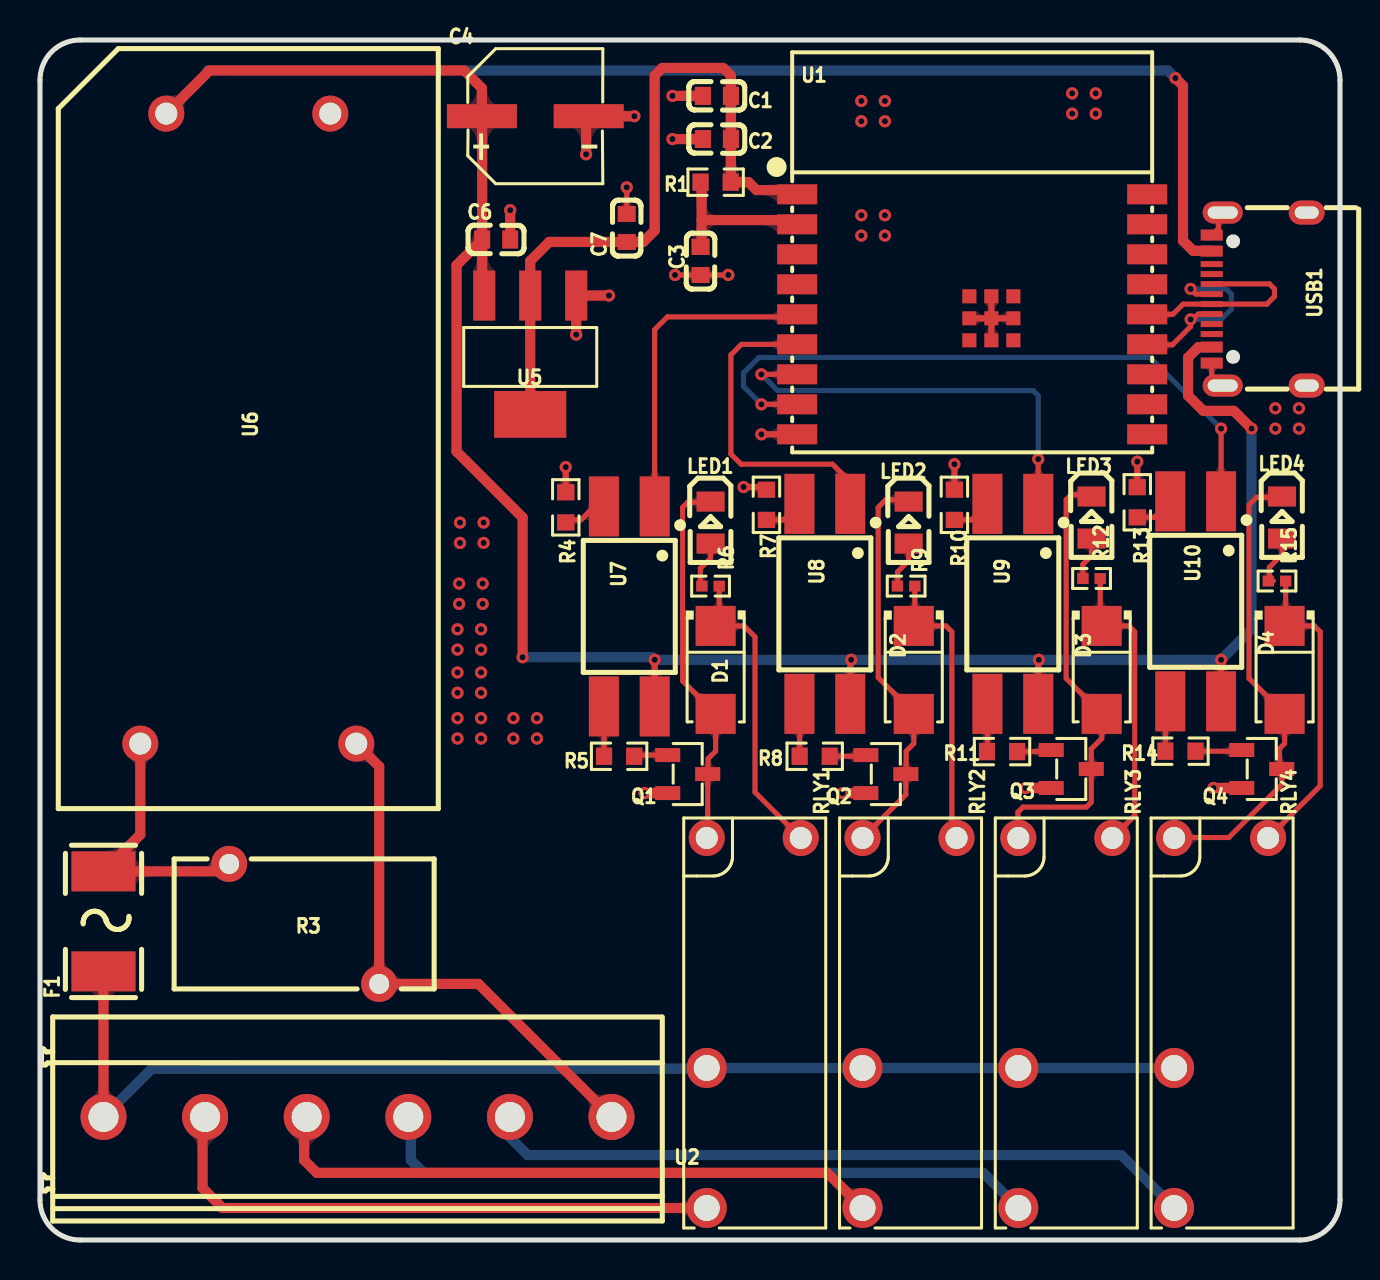
[diagram p2: board, top side]
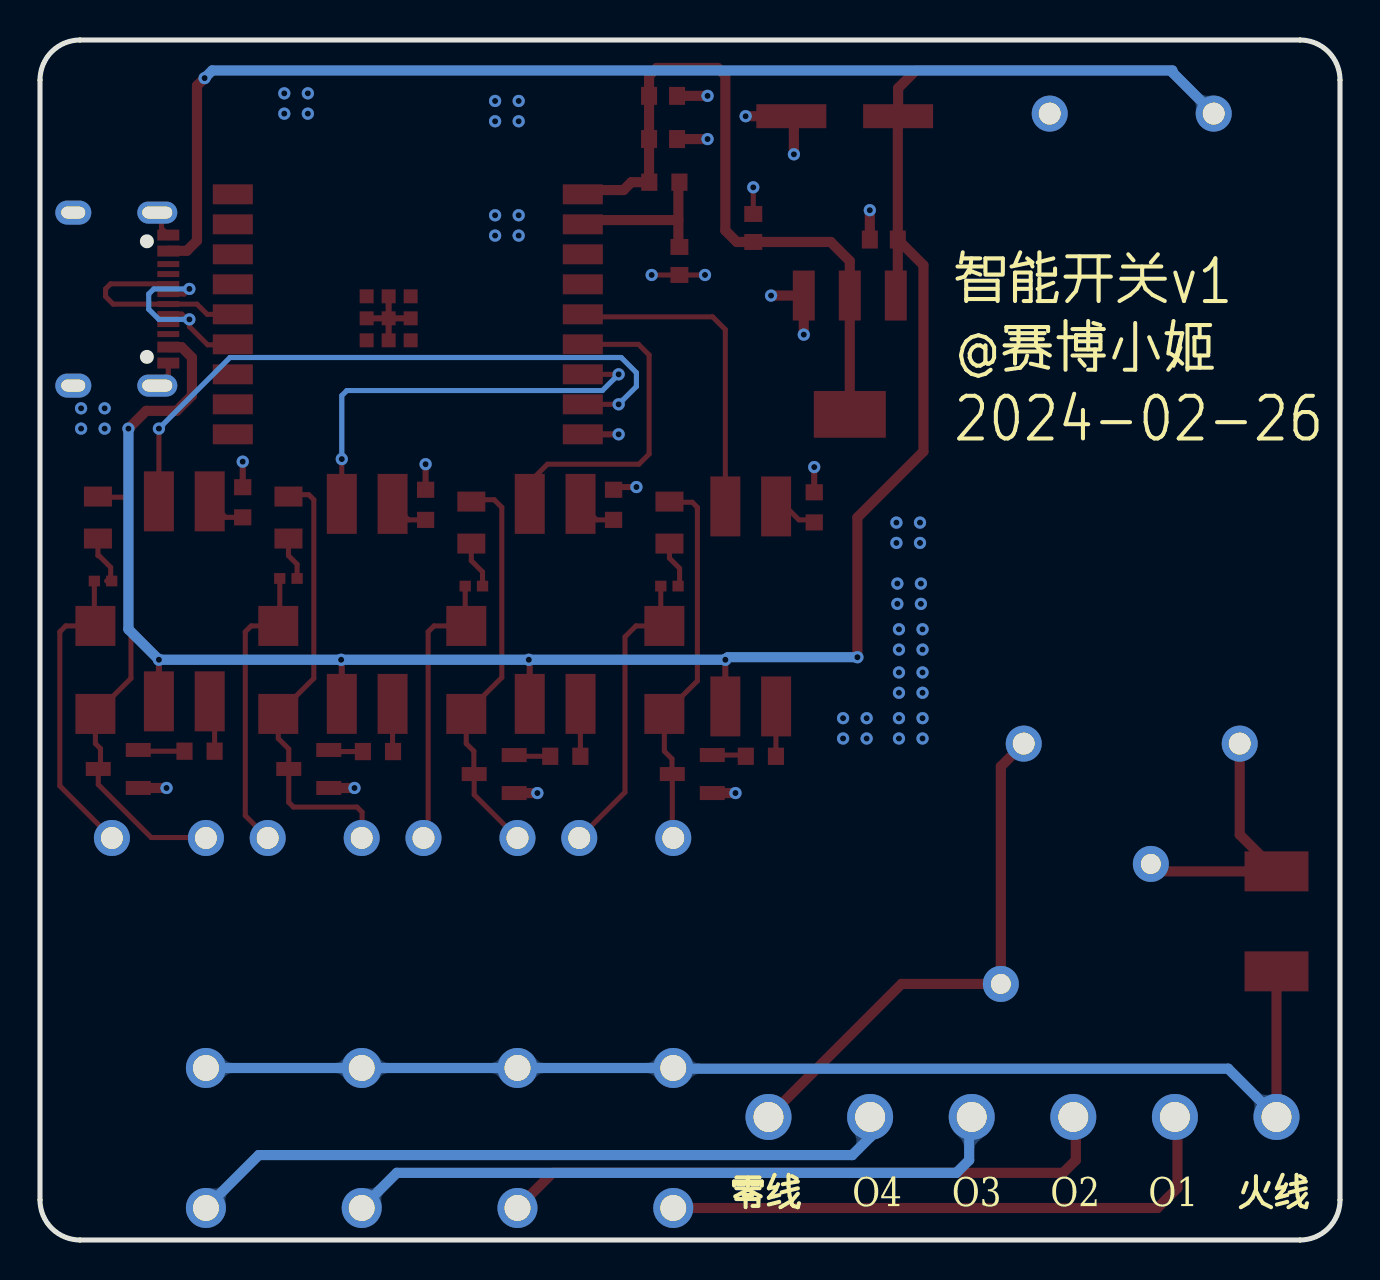
[diagram p3: board, bottom side, seen from below]

Outline 65 x 60 mm; copper layers: Top Layer, Bottom Layer. Coordinates in mm from the lower left corner of the outline.
Outline path: 0,58 0,2 arc(0.59,0.59) 2,0 63,0 arc(64.41,0.59) 65,2 65,58 arc(64.41,59.41) 63,60 2,60 arc(0.59,59.41) 0,58
Stack: Top Layer 0.035mm / Dielectric1 1.51mm FR4 er 4.5 / Bottom Layer 0.035mm

## Design rules (mm)
net USB_D-: DP1
net USB_D+: DP1
template: JLCPCB Capability(Two Layers Board)
spacing copperThickness1oz (default): track to track 0.102, other pairs 0.152 to 0.3
spacing copperThickness2oz: track to track 0.203, other pairs 0.152 to 0.3
track width copperThickness1oz (default): min 0.127, default 0.254, max 2.54
track width copperThickness2oz: min 0.203, default 0.254, max 2.54
differential pair differentialPair (default): width min 0.127, default 0.254, max 2.54; gap min 0.152, default 0.152
via viaSize (default): diameter min 0.5, default 0.61, max 10; hole min 0.3, default 0.305, max 6.3

## Placement (name value [footprint] x y rotation side)
C1  10uF  [C0603]  33.85 57.21 0 top
C2  100nF  [C0603]  33.85 55.05 0 top
C3  1uF  [C0603]  33.03 48.95 90 top
C4  100uF  [CAP-SMD_BD6.3-L6.6-W6.6-LS7.3-FD]  24.76 56.19 0 top
C6  10uF  [C0603]  22.81 50.02 0 top
C7  10uF  [C0603]  29.34 50.6 90 top
D1  M4  [SMA_L4.3-W2.6-LS5.2-RD]  33.78 28.5 270 top
D2  M4  [SMA_L4.3-W2.6-LS5.2-RD]  43.69 28.5 270 top
D3  M4  [SMA_L4.3-W2.6-LS5.2-RD]  53.09 28.5 270 top
D4  M4  [SMA_L4.3-W2.6-LS5.2-RD]  62.23 28.5 270 top
F1  JFC2410-1200TS  [F2410]  3.17 15.93 90 top
LED1  NCD0805R1  [LED0805-R-RD]  33.53 35.87 270 top
LED2  NCD0805R1  [LED0805-R-RD]  43.43 35.87 270 top
LED3  NCD0805R1  [LED0805-R-RD]  52.58 36.12 270 top
LED4  NCD0805R1  [LED0805-R-RD]  62.1 36.12 270 top
Q1  S8050  [SOT-23-3_L2.9-W1.3-P1.90-LS2.4-BR]  32.38 23.3 180 top
Q2  S8050  [SOT-23-3_L2.9-W1.3-P1.90-LS2.4-BR]  42.29 23.3 180 top
Q3  S8050  [SOT-23-3_L2.9-W1.3-P1.90-LS2.4-BR]  51.56 23.55 180 top
Q4  S8050  [SOT-23-3_L2.9-W1.3-P1.90-LS2.4-BR]  61.09 23.55 180 top
R1  10kΩ  [R0603]  33.78 52.89 0 top
R3  10D561K  [RES-TH_L13.0-W6.0-P7.50-D0.9-S6.00]  13.21 15.8 0 top
R4  1kΩ  [R0603]  26.29 36.63 90 top
R5  1kΩ  [R0603]  28.96 24.19 0 top
R6  1kΩ  [R0402]  33.53 32.69 180 top
R7  1kΩ  [R0603]  36.32 36.76 90 top
R8  1kΩ  [R0603]  38.74 24.19 0 top
R9  1kΩ  [R0402]  43.31 32.69 180 top
R10  1kΩ  [R0603]  45.72 36.76 90 top
R11  1kΩ  [R0603]  48.1 24.42 0 top
R12  1kΩ  [R0402]  52.58 33.08 180 top
R13  1kΩ  [R0603]  54.86 36.89 90 top
R14  1kΩ  [R0603]  57.02 24.44 0 top
R15  1kΩ  [R0402]  61.85 32.95 180 top
RLY1  G5NB-1A-E-DC5V  [RELAY-TH_G5NB-1A-E-DCXX]  35.69 10.85 270 top
RLY2  G5NB-1A-E-DC5V  [RELAY-TH_G5NB-1A-E-DCXX]  43.48 10.85 270 top
RLY3  G5NB-1A-E-DC5V  [RELAY-TH_G5NB-1A-E-DCXX]  51.27 10.85 270 top
RLY4  G5NB-1A-E-DC5V  [RELAY-TH_G5NB-1A-E-DCXX]  59.06 10.85 270 top
U1  2.4GHz  [BULETM-SMD_ESPRESSIF_ESP32-C3-WROOM-02-N4-4MB]  46.61 46.28 0 top
U2  DB128V-5.08-6P-GN-S  [CONN-TH_6P-P5.08_DIBO_DB128V-5.08]  15.88 6.15 0 top
U5  AMS1117-3.3  [SOT-223-3_L6.5-W3.4-P2.30-LS7.0-BR]  24.51 44.25 90 top
U6  TAS3-5-WEDT  [PWRM-TH_TAS3-XX-WEDT]  10.41 40.57 90 top
U7  EL817S1(C)(TU)-G  [OPTO-SMD-4_L4.6-W6.5-P2.54-LS10.3-TL]  29.46 31.68 270 top
U8  EL817S1(C)(TU)-G  [OPTO-SMD-4_L4.6-W6.5-P2.54-LS10.3-TL]  39.24 31.81 270 top
U9  EL817S1(C)(TU)-G  [OPTO-SMD-4_L4.6-W6.5-P2.54-LS10.3-TL]  48.64 31.81 270 top
U10  EL817S1(C)(TU)-G  [OPTO-SMD-4_L4.6-W6.5-P2.54-LS10.3-TL]  57.78 31.93 270 top
USB1  TYPE-C 16PIN 2MD(073)  [USB-C-SMD_TYPE-C-6PIN-2MD-073]  60.96 47.05 90 top

## Footprints (pads in the part's own frame, mm; a bottom-side part is the same pattern mirrored in y, then rotated)
BULETM-SMD_ESPRESSIF_ESP32-C3-WROOM-02-N4-4MB
  rect 2x1 smd: 1(-8.75,6) 2(-8.75,4.5) 3(-8.75,3) 4(-8.75,1.5) 5(-8.75,0) 6(-8.75,-1.5) 7(-8.75,-3) 8(-8.75,-4.5) 9(-8.75,-6) 10(8.75,-6) 11(8.75,-4.5) 12(8.75,-3) 13(8.75,-1.5) 14(8.75,0) 15(8.75,1.5) 16(8.75,3) 17(8.75,4.5) 18(8.75,6)
  rect 0.7x0.7 smd: 19(-0.14,0.9) 19(-0.14,-0.2) 19(-0.14,-1.3) 19(0.96,0.9) 19(0.96,-0.2) 19(0.96,-1.3) 19(2.06,0.9) 19(2.06,-0.2) 19(2.06,-1.3)
C0603
  rect 0.8x0.9 smd: 1(-0.7,0) 2(0.7,0)
CAP-SMD_BD6.3-L6.6-W6.6-LS7.3-FD
  rect 3.5x1.2 smd: 1(-2.67,0) 2(2.67,0)
CONN-TH_6P-P5.08_DIBO_DB128V-5.08
  round 2.3 hole 1.5: 1(-12.7,0) 2(-7.62,0) 3(-2.54,0) 4(2.54,0) 5(7.62,0) 6(12.7,0)
F2410
  rect 2x3.2 smd: 1(-2.5,0) 2(2.5,0)
LED0805-R-RD
  rect 1x1.399 smd: 1(1.05,0) 2(-1.05,0)
OPTO-SMD-4_L4.6-W6.5-P2.54-LS10.3-TL
  rect 3x1.5 smd: 1(-5,1.27) 2(-5,-1.27) 3(5,-1.27) 4(5,1.27)
PWRM-TH_TAS3-XX-WEDT
  round 1.8 hole 1.1: 1(-15.75,5.4) 2(-15.75,-5.4) 3(15.75,4.1) 4(15.75,-4.1)
R0402
  rect 0.566x0.54 smd: 1(-0.433,0) 2(0.433,0)
R0603
  rect 0.806x0.864 smd: 1(-0.753,0) 2(0.753,0)
RELAY-TH_G5NB-1A-E-DCXX
  round 1.8 hole 1.1: 1(-9.25,-2.35) 4(-9.25,2.35)
  round 2 hole 1.3: 2(2.25,-2.35) 3(9.25,-2.35)
RES-TH_L13.0-W6.0-P7.50-D0.9-S6.00
  round 1.8 hole 1: 1(-3.75,3) 2(3.75,-3)
SMA_L4.3-W2.6-LS5.2-RD
  rect 2x2 smd: 1(-2.2,0) 2(2.2,0)
SOT-23-3_L2.9-W1.3-P1.90-LS2.4-BR
  rect 1.25x0.7 smd: 1(1,-0.95) 2(1,0.95) 3(-1,0)
SOT-223-3_L6.5-W3.4-P2.30-LS7.0-BR
  rect 2.5x1.1 smd: 1(2.97,-2.3) 2(2.97,0) 3(2.97,2.3)
  rect 2.34x3.6 smd: 4(-2.97,0)
USB-C-SMD_TYPE-C-6PIN-2MD-073
  rect 0.55x1.1 smd: 1(-3.2,2.375) 2(-2.4,2.375) 11(2.4,2.375) 12(3.2,2.375)
  rect 0.3x1.1 smd: 3(-1.75,2.375) 4(-1.25,2.375) 5(-0.75,2.375) 6(-0.25,2.375) 7(0.25,2.375) 8(0.75,2.375) 9(1.25,2.375) 10(1.75,2.375)
  oval 1.1x2 hole 0.6x1.5: 13(-4.325,1.825) 14(4.325,1.825)
  oval 1.2x1.8 hole 0.6x1.2: 13(-4.325,-2.375) 14(4.325,-2.375)

## Nets
As in the schematic.

Pads without a net: U1 3 4 10 11 12 15 16 17 18; USB1 3 4 9 10

## Via types
v1: diameter 0.61, hole 0.305, Top Layer to Bottom Layer, 72 vias

## Routing (per net, layer and track width the routed paths; a pad name or vN(x,y) marks a point on that pad's centre or on a via; arc(x,y) is an arc through that point)
+3.3V: length 34.5
  Top Layer w0.508: 37.21,52.5 35.82,52.5 35.43,52.89 34.59,52.89 34.55,52.94 C2.2 C1.2 34.55,58.22 34.16,58.6 31.12,58.6 30.73,58.22 30.73,50.47 30.16,49.9 C7.1 25.46,49.9 24.51,48.95 U5.2 U5.4
+5V: length 174.9
  Top Layer w0.305: U9.4 49.91,28.98 v1(49.94,29.01) ; v1(40.56,29.01) 40.51,28.97 U8.4 ; U10.4 v1(59.06,29.01) ; U7.4 v1(30.73,29.01)
  Top Layer w0.508: v1(56.77,58.09) 57.15,57.71 57.15,49.97 57.66,49.46 58.57,49.46 USB1.11 ; v1(24.13,29.14) 24.13,36.12 20.83,39.43 20.83,48.74 C6.1 ; C6.1 22.11,56.18 C4.1 22.09,57.59 21.21,58.48 8.47,58.48 U6.3 ; C6.1 22.11,47.32 22.21,47.22 ; USB1.2 57.93,44.65 57.4,44.12 57.4,42.22 58.17,41.46 59.69,41.46 v1(60.58,40.57)
  Bottom Layer w0.508: U6.3 8.38,58.39 8.38,58.48 56.39,58.48 v1(56.77,58.09) ; v1(24.13,29.14) 30.61,29.14 v1(30.73,29.01) v1(40.56,29.01) v1(49.94,29.01) v1(59.06,29.01) 60.58,30.54 v1(60.58,40.57)
GND: length 35.3
  Top Layer w0.254: USB1.12 58.93,50.59 58.93,51.16 USB1.14 ; USB1.13 58.59,43.27 USB1.1 ; v1(31.75,48.25) v1(34.42,48.25) ; C7.2 v1(29.34,52.63)
  Top Layer w0.305: U1.9 v1(36.07,40.28) ; v1(35.18,37.65) 36.19,37.65 R7.2 ; 47.57,46.08 47.57,44.98 ; 47.57,46.08 U1.19 ; 47.57,46.08 46.47,46.08 ; 47.57,46.08 47.57,47.18 ; R13.2 v1(54.86,38.92) ; R10.2 v1(45.72,38.79) ; R4.2 v1(26.29,38.65)
  Top Layer w0.508: v1(27.31,54.28) 27.31,56.06 27.44,56.19 v1(29.72,56.19) ; v1(26.81,45.27) U5.1 v1(28.45,47.22) ; C6.2 v1(23.51,51.49) ; Q3.2 v1(49.28,22.6) ; C2.1 v1(31.62,55.05) ; Q2.2 v1(40.13,22.35) ; C1.1 v1(31.62,57.21) ; Q4.2 v1(58.67,22.6) ; Q1.2 v1(30.23,22.35)
  Bottom Layer w0.254: v1(30.23,22.35) 30.23,22.41
  vias: v1(20.87,30.54) v1(20.87,29.52) v1(20.87,28.38) v1(20.87,27.36) v1(20.87,26.09) v1(20.87,25.08) v1(21,35.87) v1(21,34.85) v1(20.96,32.82) v1(20.96,31.81) v1(22.13,32.82) v1(22.13,31.81) v1(22.05,30.54) v1(22.05,29.52) v1(22.05,28.38) v1(22.05,27.36) v1(22.05,26.09) v1(22.05,25.08) v1(22.18,35.87) v1(22.18,34.85) v1(23.67,26.09) v1(23.67,25.08) v1(24.85,26.09) v1(24.85,25.08) v1(41.07,56.95) v1(41.07,55.94) v1(41.07,51.24) v1(41.07,50.22) v1(42.25,56.95) v1(42.25,55.94) v1(42.25,51.24) v1(42.25,50.22) v1(51.61,57.33) v1(51.61,56.32) v1(52.79,57.33) v1(52.79,56.32) v1(61.77,41.58) v1(61.77,40.57) v1(62.95,41.58) v1(62.95,40.57)
IO6: length 16.3
  Top Layer w0.254: U1.5 37.73,46.16 31.37,46.16 30.73,45.52 U7.1
IO7: length 16.1
  Top Layer w0.254: U1.6 35.08,44.78 34.54,44.25 34.54,39.3 35.05,38.79 39.62,38.79 40.51,37.9 U8.1
IO8: length 21.5
  Top Layer w0.254: U1.7 v1(36.07,43.28) ; v1(49.91,39.05) U9.1
  Bottom Layer w0.254: v1(49.91,39.05) 49.91,42.22 49.66,42.47 36.88,42.47 v1(36.07,43.28)
IO9: length 33
  Top Layer w0.254: v1(59.06,40.57) U10.1 ; U1.8 v1(36.07,41.78)
  Bottom Layer w0.254: v1(59.06,40.57) 55.5,44.12 35.94,44.12 35.18,43.36 35.18,42.67 v1(36.07,41.78)
L: length 61.8
  Top Layer w0.508: U2.1 F1.1
  Bottom Layer w0.508: U2.1 5.59,8.56 33.3,8.56 33.34,8.6 RLY2.2 RLY3.2 RLY4.2
L1: length 13.6
  Top Layer w0.508: U6.1 5.01,20.27 F1.2 9.09,18.43 R3.1
N: length 26.9
  Top Layer w0.508: U6.2 16.96,23.67 R3.2 21.92,12.8 U2.6
R1_OUT: length 29.2
  Top Layer w0.508: U2.2 8.13,6.03 8.13,2.6 9.12,1.6 33.34,1.6
R2_OUT: length 31.1
  Top Layer w0.508: U2.3 13.21,6.03 13.21,3.99 13.84,3.36 39.37,3.36 RLY2.3
R3_OUT: length 33.6
  Bottom Layer w0.508: U2.4 18.54,6.03 18.54,3.99 19.18,3.36 47.16,3.36 RLY3.3
R4_OUT: length 35.7
  Bottom Layer w0.508: RLY4.3 54.06,4.25 24.38,4.25 23.5,5.14 U2.5
USB_D+: length 10.4
  Top Layer w0.254: U1.14 56.64,46.28 57.15,46.79 58.58,46.79 ; 58.58,46.79 61.34,46.79 61.72,47.17 61.72,47.55 61.47,47.81 58.6,47.81 USB1.8 ; 58.58,46.79 USB1.6
USB_D-: length 10.4
  Top Layer w0.254: v1(57.53,47.55) 57.79,47.3 USB1.7 ; U1.13 55.38,44.76 56.62,44.76 57.53,45.67 v1(57.53,46.03) 57.65,46.03 57.91,46.3 USB1.5
  Bottom Layer w0.254: v1(57.53,47.55) 59.31,47.55 59.56,47.3 59.56,46.54 59.06,46.03 v1(57.53,46.03)
$1N798: length 7.4
  Top Layer w0.254: 33.09,51 33.08,50.98 33.08,51 33.09,51
  Top Layer w0.508: 37.21,51 33.09,51 ; C3.2 33.08,49.7 33.08,50.98 ; 33.08,51 33.08,52.89 33.08,52.89
$1N5128: length 2.2
  Top Layer w0.254: 26.29,36.01 27.05,36.01 27.72,36.68 U7.2
$1N5169: length 2.5
  Top Layer w0.254: U7.3 28.2,26.67 R5.1
$1N5245: length 1.7
  Top Layer w0.254: R5.2 29.77,24.25 Q1.1
$1N5743: length 15.3
  Top Layer w0.254: RLY1.4 35.75,22.39 35.75,30.16 35.2,30.7 D1.1 33.96,30.88 R6.1
$1N5747: length 2.4
  Top Layer w0.254: LED1.1 33.53,34.09 33.02,33.58 33.02,32.77 R6.2
$1N5759: length 18.9
  Top Layer w0.254: LED1.2 33.49,36.89 32.38,36.89 32.13,36.63 32.13,27.95 D1.2 33.78,24.44 33.4,24.06 33.4,23.31 Q1.3 33.38,20.15 33.34,20.1
$1N6153: length 2
  Top Layer w0.254: U8.2 37.17,36.01 R7.1
$1N6157: length 2.6
  Top Layer w0.254: R8.1 37.98,26.8 U8.3
$1N6159: length 1.8
  Top Layer w0.254: R8.2 41.23,24.19 Q2.1
$1N6167: length 14.4
  Top Layer w0.254: RLY2.4 45.59,20.33 45.59,30.41 45.3,30.7 D2.1 43.74,30.76 R9.1
$1N6170: length 2.4
  Top Layer w0.254: LED2.1 43.43,33.97 42.87,33.41 R9.2
$1N6172: length 20
  Top Layer w0.254: LED2.2 43.34,37.01 42.29,37.01 41.91,36.63 41.91,28.12 43.69,26.34 D2.2 43.69,24.82 43.31,24.44 43.31,23.31 Q2.3 43.29,22.27 RLY2.1
$1N6567: length 2
  Top Layer w0.254: R10.1 46.57,36.01 47.37,36.81
$1N6571: length 2.4
  Top Layer w0.254: 47.37,26.81 47.37,24.44 R11.1
$1N6573: length 1.7
  Top Layer w0.254: R11.2 50.48,24.42 Q3.1
$1N6581: length 14.9
  Top Layer w0.254: RLY3.4 54.74,21.22 54.74,30.41 54.44,30.7 D3.1 53.01,30.78 R12.1
$1N6584: length 2.2
  Top Layer w0.254: LED3.1 52.58,34.22 52.15,33.79 R12.2
$1N6586: length 22.7
  Top Layer w0.254: LED3.2 52.49,37.27 51.56,37.27 51.31,37.01 51.31,28.08 D3.2 53.09,25.08 52.56,24.55 Q3.3 52.56,21.88 52.32,21.65 49.15,21.65 48.9,21.39 48.9,20.12 RLY3.1
$1N6981: length 2
  Top Layer w0.254: U10.2 55.71,36.13 R13.1
$1N6985: length 2.6
  Top Layer w0.254: U10.3 56.27,26.69 R14.1
$1N6987: length 2.3
  Top Layer w0.254: R14.2 60.03,24.44 Q4.1
$1N6995: length 15.6
  Top Layer w0.254: RLY4.4 64.01,22.7 64.01,30.41 63.71,30.7 D4.1 62.28,30.76 R15.1
$1N6998: length 2.5
  Top Layer w0.254: 61.67,32.95 61.47,33.15 61.47,33.64 62.05,34.22 62.1,34.22 LED4.1
$1N7000: length 23.2
  Top Layer w0.254: RLY4.1 56.73,20.12 59.44,20.12 62.09,22.77 Q4.3 61.98,23.66 61.98,24.57 62.23,24.82 D4.2 60.45,28.08 60.45,36.76 60.83,37.14 62.07,37.14 LED4.2

## Copper pours and planes (outline as drawn; the poured copper is in the pictures)
GND on Top Layer: -3.68,61.27 69.6,61.27 69.6,-4.01 -3.68,-4.01
GND on Bottom Layer: -2.29,61.52 69.09,61.52 69.09,-3.25 -2.29,-3.25

Small or netless copper shapes (teardrops, artwork), in the pictures only: 170 on Top Layer, 20 on Bottom Layer

## Text on the board
Bottom Silkscreen Layer: 火线 | O1 | O2 | O3 | O4 | 零线 | 智能开关v1 / @赛博小姬 / 2024-02-26

# Board PCB2
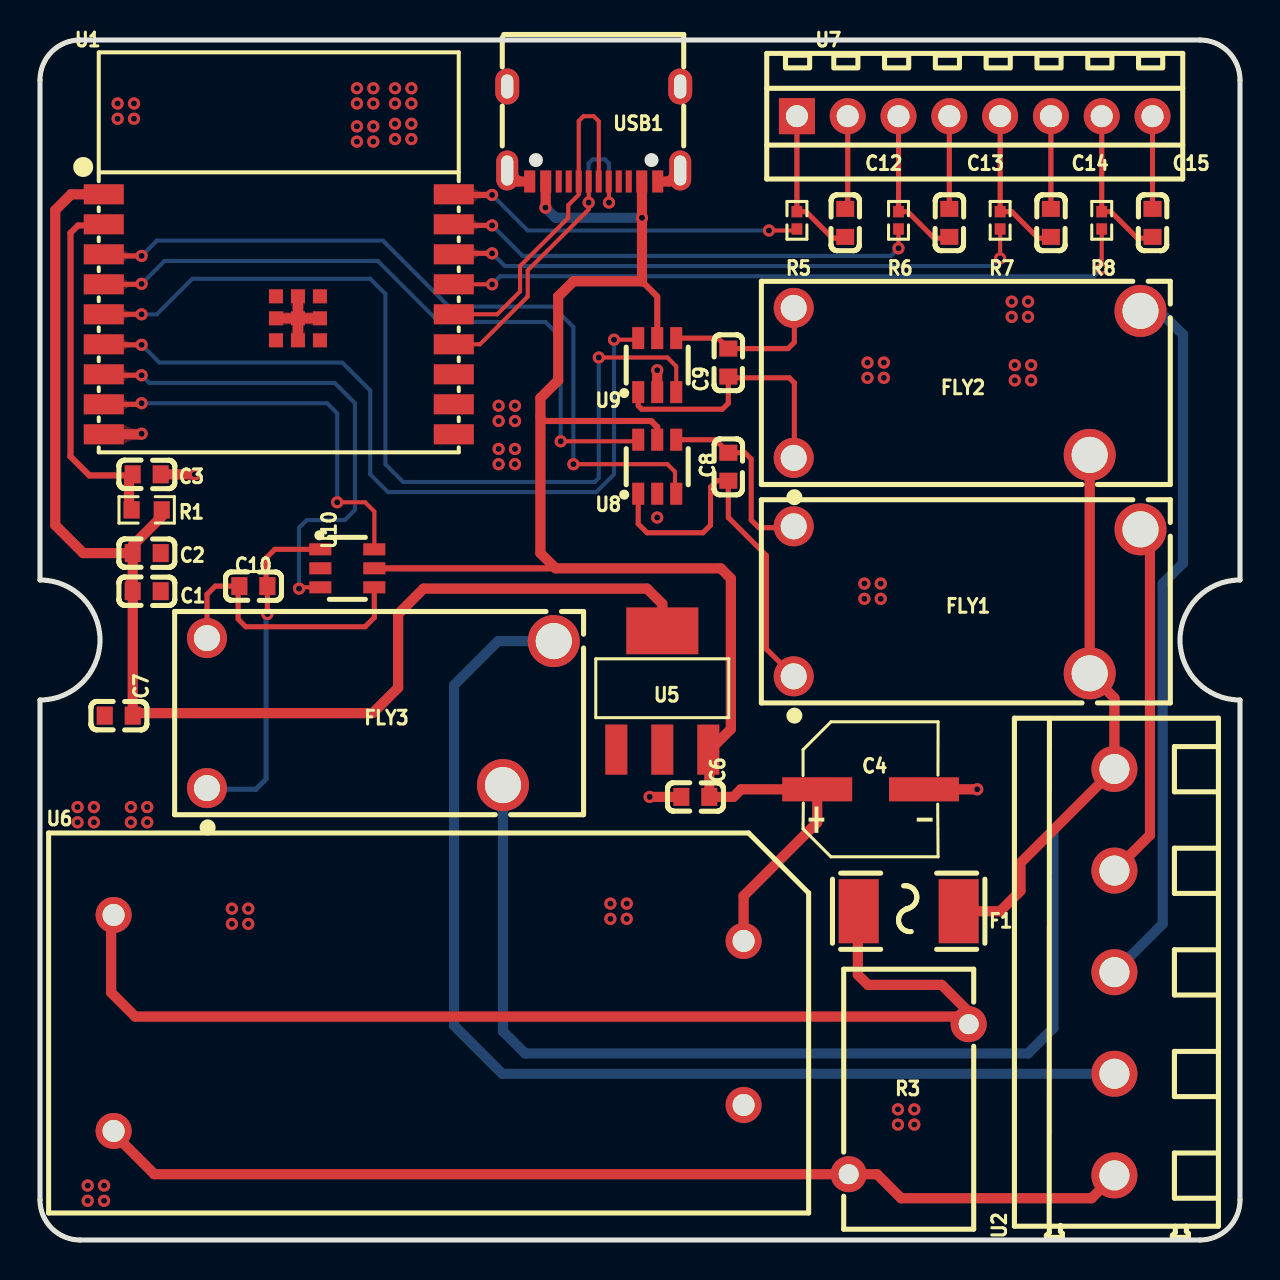
[diagram p4: board, top side]
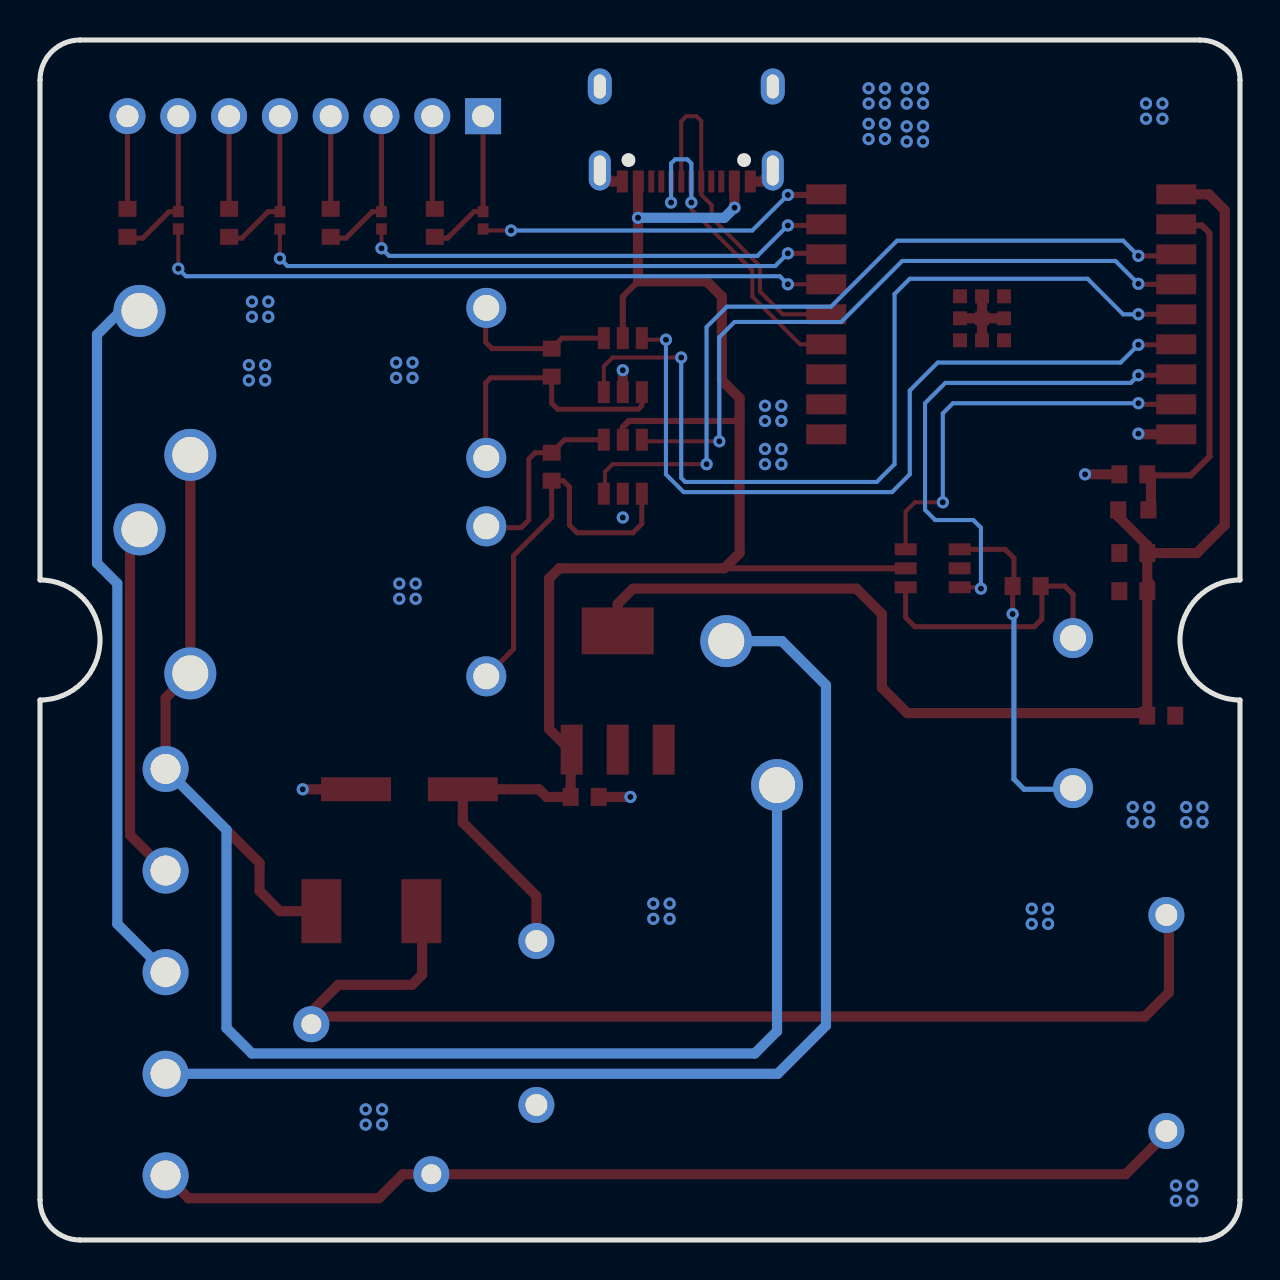
[diagram p5: board, bottom side, seen from below]

Outline 60 x 60 mm; copper layers: Top Layer, Bottom Layer. Coordinates in mm from the lower left corner of the outline.
Outline path: 0,58 0,33 arc(3,30) 0,27 0,2 arc(0.59,0.59) 2,0 58,0 arc(59.41,0.59) 60,2 60,27 arc(57,30) 60,33 60,58 arc(59.41,59.41) 58,60 2,60 arc(0.59,59.41) 0,58
Stack: Top Layer 0.035mm / Dielectric1 1.51mm FR4 er 4.5 / Bottom Layer 0.035mm

## Design rules (mm)
net USB_D-: DP1
net USB_D+: DP1
template: 自定义配置
spacing copperThickness1oz (default): track to track 0.102, other pairs 0.152 to 0.3
spacing copperThickness2oz: track to track 0.203, other pairs 0.152 to 0.3
track width copperThickness1oz (default): min 0.127, default 0.254, max 2.54
track width copperThickness2oz: min 0.203, default 0.254, max 2.54
differential pair differentialPair (default): width min 0.127, default 0.254, max 2.54; gap min 0.152, default 0.152
via viaSize (default): diameter min 0.5, default 0.61, max 10; hole min 0.3, default 0.305, max 6.299
net +5V uses copperRegion1
net +3.3V uses copperRegion1

## Placement (name value [footprint] x y rotation side)
C1  10uF  [C0603]  5.33 32.44 180 top
C2  100nF  [C0603]  5.33 34.35 180 top
C3  1uF  [C0603]  5.33 38.28 180 top
C4  100uF  [CAP-SMD_BD6.3-L6.6-W6.6-LS7.3-FD]  41.53 22.53 0 top
C6  10uF  [C0603]  32.77 22.15 180 top
C7  10uF  [C0603]  3.94 26.22 180 top
C8  100nF  [C0603]  34.42 38.66 90 top
C9  100nF  [C0603]  34.42 43.87 90 top
C10  100nF  [C0603]  10.67 32.69 180 top
C12  100nF  [C0603]  40.26 50.86 270 top
C13  100nF  [C0603]  45.47 50.86 270 top
C14  100nF  [C0603]  50.55 50.86 270 top
C15  100nF  [C0603]  55.63 50.86 270 top
F1  JFC2410-1200TS  [F2410]  43.43 16.44 180 top
FLY1  FH44L-1AT-L1-DC5V  [RELAY-TH_FH44L-1AT-L1-DC5V]  46.35 31.93 0 top
FLY2  FH44L-1AT-L1-DC5V  [RELAY-TH_FH44L-1AT-L1-DC5V]  46.35 42.86 0 top
FLY3  FH44L-1AT-L1-DC5V  [RELAY-TH_FH44L-1AT-L1-DC5V]  17.02 26.34 0 top
R1  10kΩ  [R0603]  5.33 36.5 0 top
R3  10D561K  [RES-TH_L13.0-W6.0-P7.50-D0.9-S6.00]  43.43 7.04 270 top
R5  220Ω  [R0402]  37.85 50.98 90 top
R6  220Ω  [R0402]  42.93 50.98 90 top
R7  220Ω  [R0402]  48.01 50.98 90 top
R8  220Ω  [R0402]  53.09 50.98 270 top
U1  2.4GHz  [BULETM-SMD_ESPRESSIF_ESP32-C3-WROOM-02-N4-4MB]  11.94 46.28 0 top
U2  DB128V-5.08-5P-GN-S  [CONN-TH_5P-P5.08_DIBO_DB128V-5.08-5P-GN-S]  53.72 13.39 90 top
U5  AMS1117-3.3  [SOT-223-3_L6.5-W3.4-P2.30-LS7.0-BR]  31.12 27.49 270 top
U6  TAS3-5-WEDT  [PWRM-TH_TAS3-XX-WEDT]  19.43 10.85 0 top
U7  DB125-2.54-8P-GN-S  [CONN-TH_DB125-2.54-8P-GN]  46.74 56.19 0 top
U8  CN8023B  [SOT-23-6_L2.9-W1.6-P0.95-LS2.8-BR]  30.86 38.66 270 top
U9  CN8023B  [SOT-23-6_L2.9-W1.6-P0.95-LS2.8-BR]  30.86 43.74 270 top
U10  CN8023B  [SOT-23-6_L2.9-W1.6-P0.95-LS2.8-BR]  15.37 33.58 180 top
USB1  TYPE-C 16PIN 2MD(073)  [USB-C-SMD_TYPE-C-6PIN-2MD-073]  27.69 55.3 180 top

## Footprints (pads in the part's own frame, mm; a bottom-side part is the same pattern mirrored in y, then rotated)
BULETM-SMD_ESPRESSIF_ESP32-C3-WROOM-02-N4-4MB
  rect 2x1 smd: 1(-8.75,6) 2(-8.75,4.5) 3(-8.75,3) 4(-8.75,1.5) 5(-8.75,0) 6(-8.75,-1.5) 7(-8.75,-3) 8(-8.75,-4.5) 9(-8.75,-6) 10(8.75,-6) 11(8.75,-4.5) 12(8.75,-3) 13(8.75,-1.5) 14(8.75,0) 15(8.75,1.5) 16(8.75,3) 17(8.75,4.5) 18(8.75,6)
  rect 0.7x0.7 smd: 19(-0.14,0.9) 19(-0.14,-0.2) 19(-0.14,-1.3) 19(0.96,0.9) 19(0.96,-0.2) 19(0.96,-1.3) 19(2.06,0.9) 19(2.06,-0.2) 19(2.06,-1.3)
C0603
  rect 0.8x0.9 smd: 1(-0.7,0) 2(0.7,0)
CAP-SMD_BD6.3-L6.6-W6.6-LS7.3-FD
  rect 3.5x1.2 smd: 1(-2.67,0) 2(2.67,0)
CONN-TH_5P-P5.08_DIBO_DB128V-5.08-5P-GN-S
  round 2.3 hole 1.5: 1(-10.16,0) 2(-5.08,0) 3(0,0) 4(5.08,0) 5(10.16,0)
CONN-TH_DB125-2.54-8P-GN
  rect 1.8x1.8 hole 1.1: 1(-8.89,0)
  round 1.8 hole 1.1: 2(-6.35,0) 3(-3.81,0) 4(-1.27,0) 5(1.27,0) 6(3.81,0) 7(6.35,0) 8(8.89,0)
F2410
  rect 2x3.2 smd: 1(-2.5,0) 2(2.5,0)
PWRM-TH_TAS3-XX-WEDT
  round 1.8 hole 1.1: 1(-15.75,5.4) 2(-15.75,-5.4) 3(15.75,4.1) 4(15.75,-4.1)
R0402
  rect 0.566x0.54 smd: 1(-0.433,0) 2(0.433,0)
R0603
  rect 0.806x0.864 smd: 1(-0.753,0) 2(0.753,0)
RELAY-TH_FH44L-1AT-L1-DC5V
  round 2 hole 1.3: 1(-8.67,-3.75) 4(-8.67,3.75)
  round 2.6 hole 1.8: 2(6.13,-3.6) 3(8.67,3.6)
RES-TH_L13.0-W6.0-P7.50-D0.9-S6.00
  round 1.8 hole 1: 1(-3.75,3) 2(3.75,-3)
SOT-23-6_L2.9-W1.6-P0.95-LS2.8-BR
  rect 1.1x0.6 smd: 1(1.35,-0.95) 2(1.35,0) 3(1.35,0.95) 4(-1.35,0.95) 5(-1.35,0) 6(-1.35,-0.95)
SOT-223-3_L6.5-W3.4-P2.30-LS7.0-BR
  rect 2.5x1.1 smd: 1(2.97,-2.3) 2(2.97,0) 3(2.97,2.3)
  rect 2.34x3.6 smd: 4(-2.97,0)
USB-C-SMD_TYPE-C-6PIN-2MD-073
  rect 0.55x1.1 smd: 1(-3.2,2.375) 2(-2.4,2.375) 11(2.4,2.375) 12(3.2,2.375)
  rect 0.3x1.1 smd: 3(-1.75,2.375) 4(-1.25,2.375) 5(-0.75,2.375) 6(-0.25,2.375) 7(0.25,2.375) 8(0.75,2.375) 9(1.25,2.375) 10(1.75,2.375)
  oval 1.1x2 hole 0.6x1.5: 13(-4.325,1.825) 14(4.325,1.825)
  oval 1.2x1.8 hole 0.6x1.2: 13(-4.325,-2.375) 14(4.325,-2.375)

## Nets
As in the schematic.

Pads without a net: U1 10 11 12; USB1 3 4 9 10

## Via types
v1: diameter 0.61, hole 0.305, Top Layer to Bottom Layer, 99 vias

## Routing (per net, layer and track width the routed paths; a pad name or vN(x,y) marks a point on that pad's centre or on a via; arc(x,y) is an arc through that point)
+3.3V: length 67.1
  Top Layer w0.508: 4.64,34.72 6.09,36.17 6.09,36.63 ; 4.64,34.72 4.64,32.69 ; 4.64,34.72 4.63,34.73 ; U5.4 31.12,31.81 30.35,32.57 19.18,32.57 17.91,31.3 17.91,27.61 16.64,26.34 4.76,26.34 C7.1 4.64,32.69 ; 4.64,32.69 4.51,32.82 ; U1.1 1.56,52.28 0.76,51.49 0.76,35.74 2.16,34.35 C2.2 ; 5.97,36.62 5.96,36.63
+5V: length 84.1
  Top Layer w0.305: U8.5 30.86,40.64 30.56,40.95 25.23,40.95 25.02,41.16 ; 30.1,47.94 30.86,47.17 U9.5 ; 25.78,33.58 U10.5
  Top Layer w0.508: 33.47,24.47 U5.3 ; 33.47,24.47 34.54,25.55 34.54,33.08 34.04,33.58 25.78,33.58 25.02,34.35 25.02,42.09 25.91,42.98 25.91,47.17 26.67,47.94 30.1,47.94 v1(30.1,51.11) 30.1,52.91 USB1.2 ; 33.47,24.47 C6.1 34.67,22.15 35.05,22.53 C4.1 38.86,20.88 35.18,17.2 U6.3 ; v1(25.27,51.62) 25.29,51.63 USB1.11
  Bottom Layer w0.508: v1(25.27,51.62) 25.78,51.11 v1(30.1,51.11)
GND: length 34.8
  Top Layer w0.254: C13.1 U7.4 ; C12.1 40.39,51.68 U7.2 ; C14.1 U7.6 ; C15.1 U7.8
  Top Layer w0.508: v1(7.75,38.28) 5.91,38.28 ; 23.36,53.48 23.91,52.93 USB1.12 ; v1(5.08,40.31) 5.05,40.28 U1.9 ; USB1.1 31.46,52.93 USB1.13 ; U1.19 U1.19 ; U1.19 U1.19 ; U1.19 U1.19 ; U1.19 U1.19 ; C6.2 v1(30.48,22.15) ; v1(30.86,43.49) U9.2 ; 44.2,22.53 v1(46.86,22.53)
  vias: v1(1.88,21.65) v1(1.88,20.88) v1(2.39,2.72) v1(2.39,1.96) v1(2.69,21.65) v1(2.69,20.88) v1(3.2,2.72) v1(3.2,1.96) v1(3.88,56.83) v1(3.88,56.06) v1(4.54,21.65) v1(4.54,20.88) v1(4.7,56.83) v1(4.7,56.06) v1(5.36,21.65) v1(5.36,20.88) v1(9.6,16.57) v1(9.6,15.8) v1(10.41,16.57) v1(10.41,15.8) v1(15.85,57.59) v1(15.85,56.83) v1(15.85,55.68) v1(15.85,54.92) v1(16.66,57.59) v1(16.66,56.83) v1(16.66,55.68) v1(16.66,54.92) v1(17.75,57.59) v1(17.75,56.83) v1(17.75,55.81) v1(17.75,55.05) v1(18.57,57.59) v1(18.57,56.83) v1(18.57,55.81) v1(18.57,55.05) v1(22.93,41.71) v1(22.93,40.95) v1(22.93,39.55) v1(22.93,38.79) v1(23.75,41.71) v1(23.75,40.95) v1(23.75,39.55) v1(23.75,38.79) v1(28.52,16.82) v1(28.52,16.06) v1(29.34,16.82) v1(29.34,16.06) v1(30.86,36.12) v1(41.22,32.82) v1(41.22,32.06) v1(41.37,43.87) v1(41.37,43.11) v1(42.04,32.82) v1(42.04,32.06) v1(42.19,43.87) v1(42.19,43.11) v1(42.9,6.53) v1(42.9,5.77) v1(43.72,6.53) v1(43.72,5.77) v1(48.58,46.92) v1(48.58,46.16) v1(48.74,43.74) v1(48.74,42.98) v1(49.4,46.92) v1(49.4,46.16) v1(49.56,43.74) v1(49.56,42.98)
INA1: length 38.8
  Top Layer w0.203: 31.81,37.31 31.75,37.38 31.75,38.41 31.37,38.79 v1(26.67,38.79)
  Top Layer w0.254: U1.3 3.27,49.2 v1(5.08,49.2)
  Bottom Layer w0.203: v1(5.08,49.2) 5.84,49.97 17.15,49.97 20.45,46.67 25.65,46.67 26.67,45.65 v1(26.67,38.79)
INA2: length 46.1
  Top Layer w0.203: v1(27.94,44.12) 31.37,44.12 31.81,43.68 31.81,42.39
  Top Layer w0.254: v1(5.08,46.28) U1.5
  Bottom Layer w0.203: v1(5.08,46.28) 5.84,46.28 7.62,48.06 16.51,48.06 17.27,47.3 17.27,38.79 18.16,37.9 27.74,37.9 27.94,38.11 v1(27.94,44.12)
INA3: length 26.2
  Top Layer w0.203: v1(12.95,32.57) 12.83,32.57 12.76,32.63 U10.3
  Top Layer w0.254: U1.7 3.24,43.24 v1(5.08,43.24)
  Bottom Layer w0.203: v1(5.08,43.24) 5.46,42.86 14.73,42.86 15.75,41.84 15.75,36.5 15.24,36 13.34,36 12.95,35.62 v1(12.95,32.57)
INB1: length 34
  Top Layer w0.203: U8.6 29.83,39.93 v1(26.03,39.93)
  Top Layer w0.254: U1.4 5.06,47.78 v1(5.08,47.81)
  Bottom Layer w0.203: v1(26.03,39.93) 26.03,45.14 25.27,45.9 19.94,45.9 16.89,48.95 6.22,48.95 v1(5.08,47.81)
INB2: length 39.4
  Top Layer w0.203: v1(28.7,45.01) 29.83,45.01 U9.6
  Top Layer w0.254: v1(5.08,44.76) 3.21,44.76 U1.6
  Bottom Layer w0.203: v1(5.08,44.76) 5.97,43.87 15.11,43.87 16.51,42.47 16.51,38.28 17.4,37.39 27.81,37.39 28.7,38.28 v1(28.7,45.01)
INB3: length 20.3
  Top Layer w0.203: U10.6 16.72,36.42 16.26,36.89 v1(14.86,36.89)
  Top Layer w0.254: U1.8 5.03,41.78 v1(5.08,41.84)
  Bottom Layer w0.203: v1(5.08,41.84) 14.35,41.84 14.86,41.33 v1(14.86,36.89)
IO0: length 17.9
  Top Layer w0.203: R5.1 37.77,50.47 v1(36.45,50.47)
  Top Layer w0.305: v1(22.61,52.25) 20.72,52.25 U1.18
  Bottom Layer w0.203: v1(36.45,50.47) 24.38,50.47 v1(22.61,52.25)
IO1: length 24
  Top Layer w0.203: v1(42.93,49.59) R6.1
  Top Layer w0.254: v1(22.61,50.73) 20.74,50.73 U1.17
  Bottom Layer w0.203: v1(22.61,50.73) 24.13,49.2 42.54,49.2 v1(42.93,49.59)
IO2: length 29.2
  Top Layer w0.203: v1(48.01,49.08) R7.1
  Top Layer w0.254: U1.16 20.74,49.33 v1(22.61,49.33)
  Bottom Layer w0.203: v1(22.61,49.33) 23.24,48.7 47.62,48.7 v1(48.01,49.08)
IO3: length 34.7
  Top Layer w0.203: U1.15 v1(22.61,47.78) ; v1(53.09,48.57) R8.2
  Bottom Layer w0.203: v1(53.09,48.57) 52.71,48.19 23.01,48.19 v1(22.61,47.78)
L: length 82.8
  Top Layer w0.508: F1.1 48.01,16.44 49.02,17.45 49.02,18.85 U2.5 53.72,27.1 52.49,28.33 FLY2.2
  Bottom Layer w0.508: U2.5 50.67,20.5 50.67,10.6 49.4,9.33 24.26,9.33 23.15,10.44 FLY3.2
L1: length 57.1
  Top Layer w0.508: 3.56,16.25 3.56,12.38 4.76,11.17 46.35,11.17 46.35,11.49 45.09,12.76 41.4,12.76 40.89,13.26 40.89,16.65 40.93,16.69
N: length 51.7
  Top Layer w0.508: U2.1 52.58,2.09 43.05,2.09 41.85,3.29 R3.2 5.71,3.29 3.81,5.2
OA1: length 9.5
  Top Layer w0.254: 31.81,40.01 33.77,40.01 C8.2 35.24,39.36 35.56,39.05 35.56,36 35.94,35.62 37.62,35.62 FLY1.4
OA2: length 8
  Top Layer w0.254: 31.81,45.09 33.89,45.09 C9.2 37.4,44.57 37.72,44.89 37.72,46.57 FLY2.4
OA3: length 14.3
  Top Layer w0.254: FLY3.4 8.35,32.28 8.76,32.69 C10.2 9.91,32.63 9.91,31.04 10.29,30.66 16.26,30.66 16.72,31.12 U10.4
OB1: length 19.5
  Top Layer w0.254: FLY1.1 36.32,29.55 36.32,34.22 34.42,36.12 C8.1 33.84,37.96 33.53,37.65 33.53,35.74 33.15,35.36 30.35,35.36 29.91,35.8 U8.1
OB2: length 14
  Top Layer w0.254: U9.1 29.91,41.71 30.08,41.54 34.12,41.54 34.42,41.84 34.42,43.11 ; 34.42,43.11 37.47,43.11 37.72,42.86 37.72,39.14 FLY2.1 ; 34.42,43.11 34.35,43.11 34.42,43.17
OB3: length 17.2
  Top Layer w0.254: v1(11.37,31.3) C10.1 11.3,32.76 11.3,34.09 11.75,34.53 U10.1
  Bottom Layer w0.254: FLY3.1 8.41,22.53 10.79,22.53 11.3,23.04 11.3,31.3 v1(11.37,31.3)
R1_OUT: length 18
  Top Layer w0.508: U2.4 55.5,20.25 55.5,35.06 FLY1.3
R2_OUT: length 35.9
  Bottom Layer w0.508: U2.3 56.13,15.8 56.13,32.82 57.15,33.84 57.15,45.27 55.96,46.45 FLY2.3
R3_OUT: length 56.9
  Bottom Layer w0.508: U2.2 23.11,8.31 20.7,10.72 20.7,27.74 22.9,29.94 FLY3.3
USB_D+: length 17.7
  Top Layer w0.203: U1.14 22.86,46.28 24,47.43 24,48.7 26.42,51.11 26.42,51.75 26.94,52.27 26.94,55.95 27.18,56.19 27.69,56.19 27.94,55.94 27.94,52.93 USB1.6
USB_D-: length 17.9
  Top Layer w0.203: USB1.7 27.44,51.88 v1(27.43,51.87) 27.43,51.53 24.38,48.48 24.38,47.17 22,44.78 U1.13 ; v1(28.45,51.87) 28.45,52.91 USB1.5
  Bottom Layer w0.203: v1(28.45,51.87) 28.45,53.83 28.25,54.03 27.63,54.03 27.43,53.83 v1(27.43,51.87)
$1N911: length 18
  Top Layer w0.305: 4.45,38.23 2.47,38.23 1.52,39.17 1.52,50.35 1.91,50.73 3.13,50.73 U1.2
  Top Layer w0.508: 4.45,36.63 4.45,38.23 4.51,38.28
$1N5080: length 7.8
  Top Layer w0.254: U7.1 R5.2 38.3,51.42 39.62,50.09 40.2,50.09 C12.2
$1N5090: length 7.3
  Top Layer w0.254: R7.2 48.59,51.42 49.91,50.09 50.48,50.09 C14.2 ; 47.88,55.69 48.01,55.56 48.01,51.54
$1N5100: length 7.8
  Top Layer w0.254: C13.2 45.4,50.09 44.7,50.09 43.38,51.42 R6.2 ; 42.93,51.54 U7.3
$1N5121: length 7.8
  Top Layer w0.254: 53.09,51.54 U7.7 ; R8.1 53.54,51.42 54.86,50.09 55.56,50.09 C15.2

## Copper pours and planes (outline as drawn; the poured copper is in the pictures)
+3.3V on Top Layer: 29.34,29.65 29.34,26.98 30.61,25.71 31.62,25.71 32.89,26.98 32.89,29.9 29.59,29.9
GND on Top Layer: -2.29,61.91 61.98,61.91 61.98,-1.59 -2.29,-1.59
GND on Bottom Layer: 30.99,24.19 30.99,26.47 29.72,27.74 29.72,30.03 33.27,30.03 33.27,27.74 32,26.47 32,24.19
GND on Bottom Layer: -2.03,61.52 61.98,61.52 61.98,-1.98 -2.03,-1.98

Small or netless copper shapes (teardrops, artwork), in the pictures only: 27 on Top Layer
